# Altium project AMC_FMC_Carrier.PrjPcb (part 7 of 9)

## Sheet Clock_management.SchDoc
size 457 x 304 mm; DocumentNumber: 23; SheetNumber: 23; SheetTotal: 30
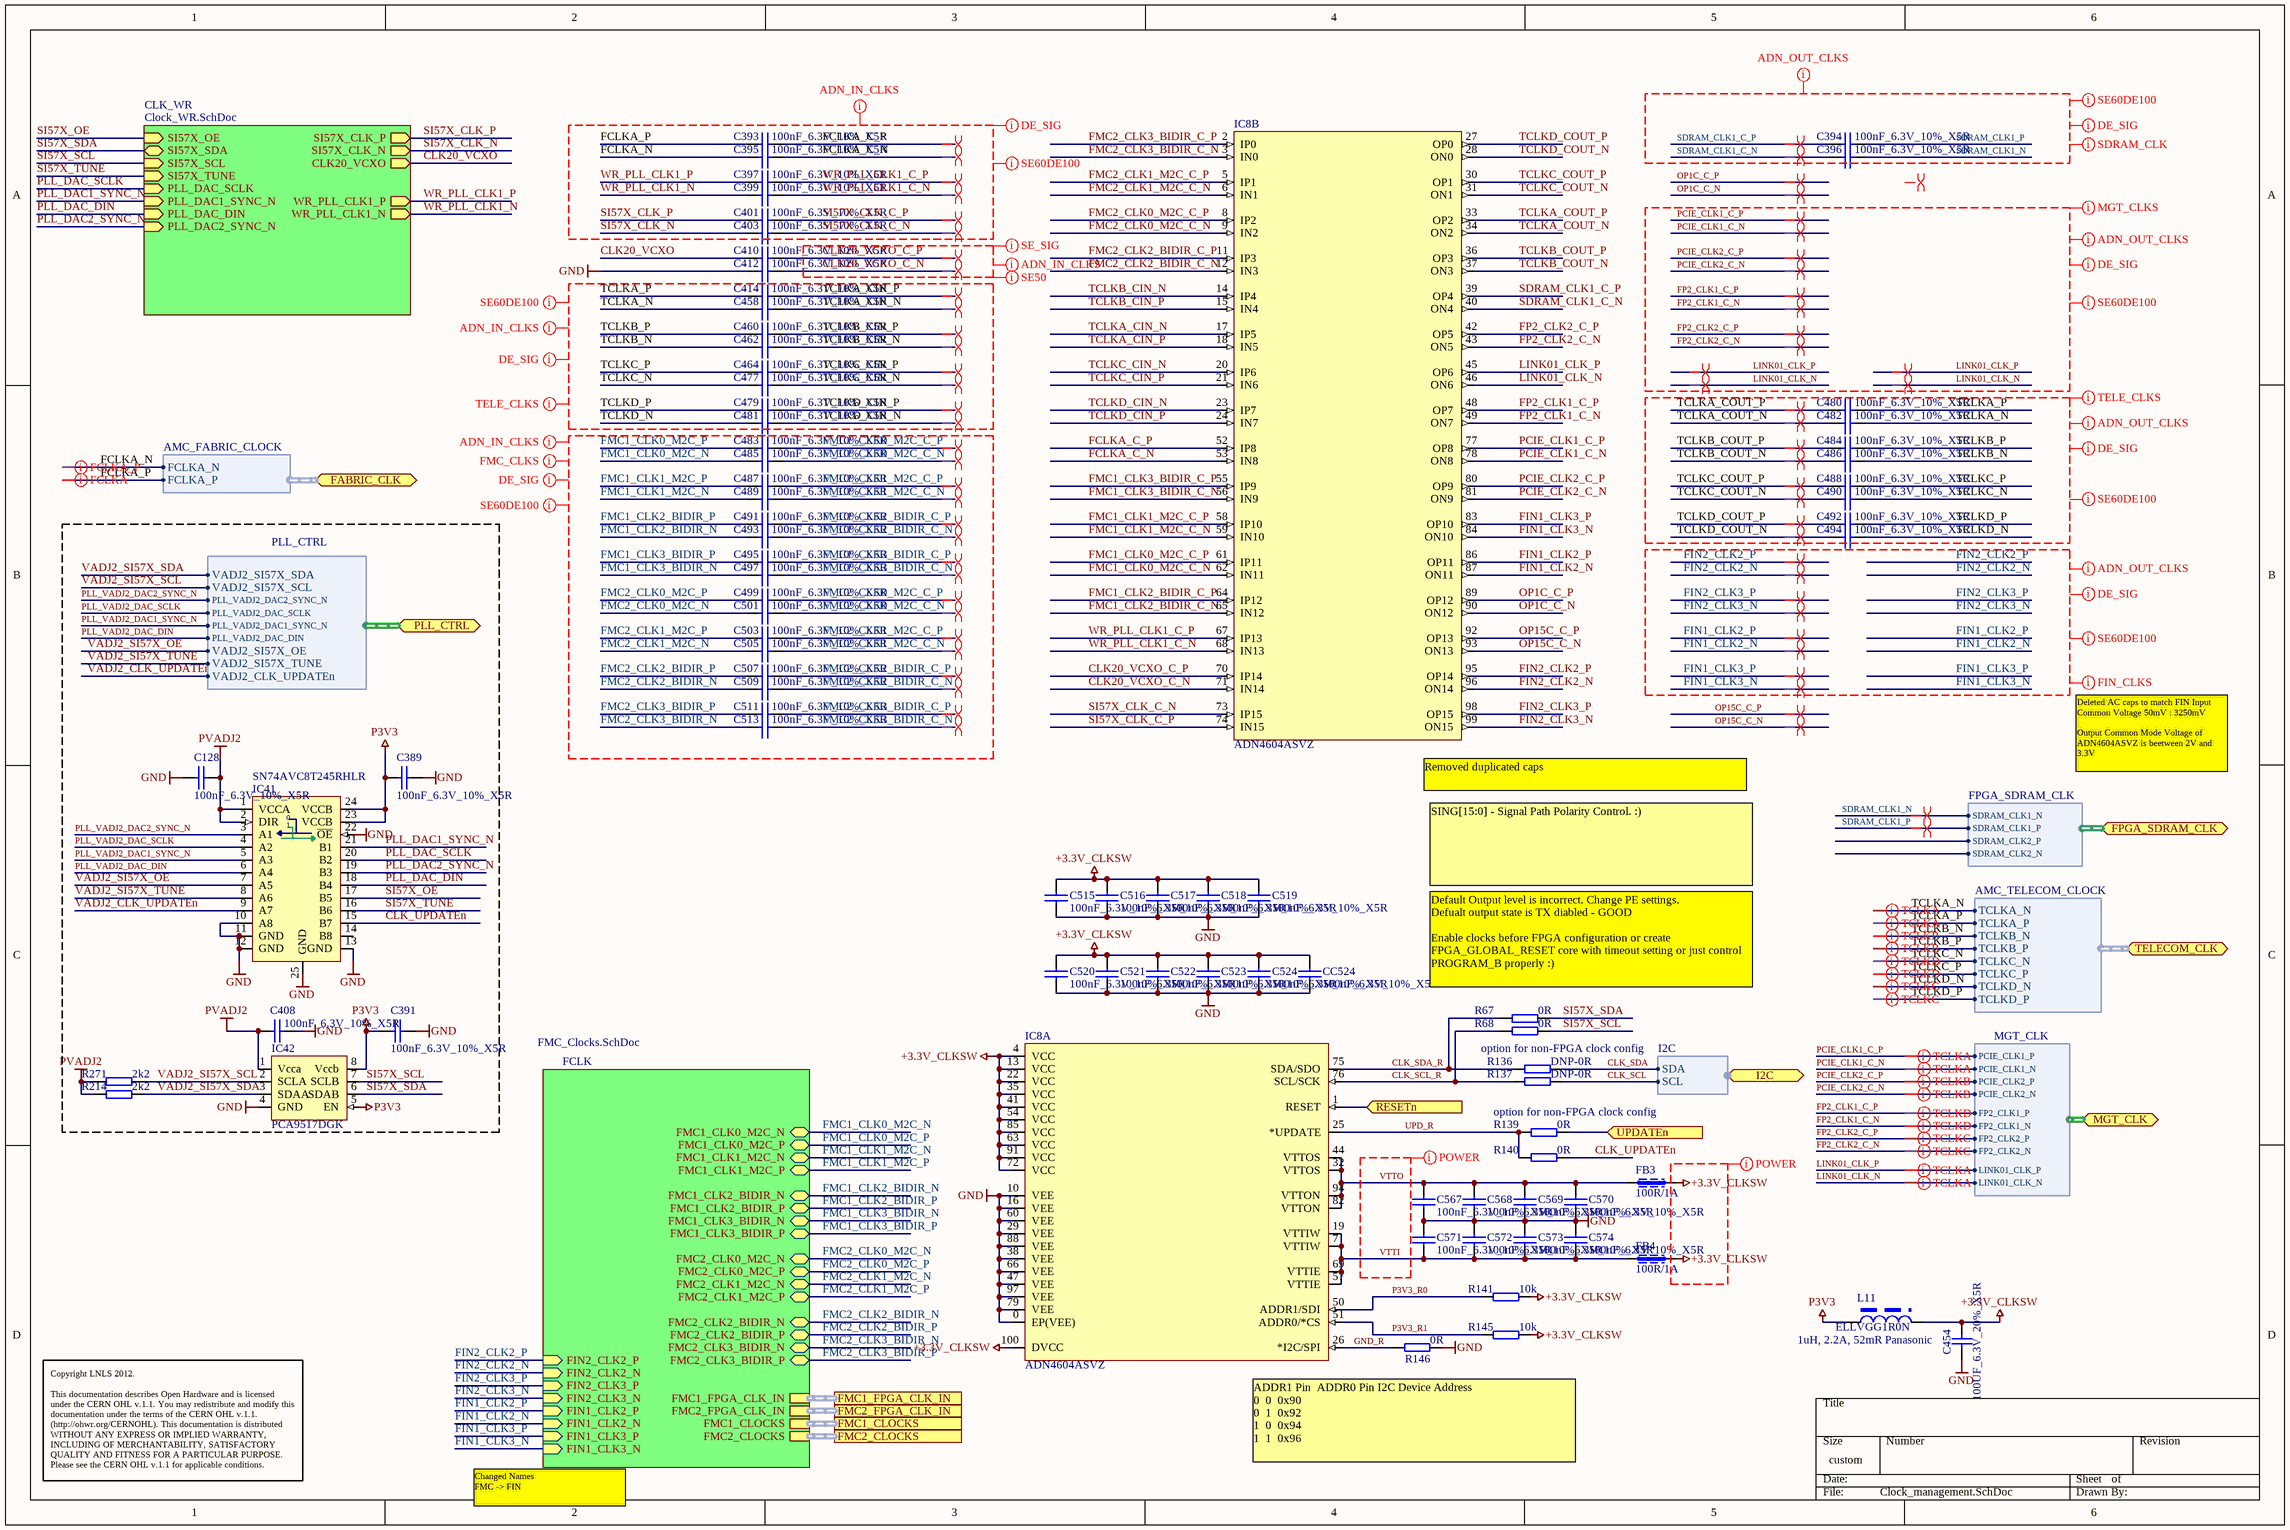
[diagram p17: Clock_management.SchDoc]

### Parts
C128  100nF_6.3V_10%_X5R  [0201C]
C389  100nF_6.3V_10%_X5R  [0201C]
C391  100nF_6.3V_10%_X5R  [0201C]
C393  100nF_6.3V_10%_X5R  [0201C]
C394  100nF_6.3V_10%_X5R  [0201C]
C395  100nF_6.3V_10%_X5R  [0201C]
C396  100nF_6.3V_10%_X5R  [0201C]
C397  100nF_6.3V_10%_X5R  [0201C]
C399  100nF_6.3V_10%_X5R  [0201C]
C401  100nF_6.3V_10%_X5R  [0201C]
C403  100nF_6.3V_10%_X5R  [0201C]
C408  100nF_6.3V_10%_X5R  [0201C]
C410  100nF_6.3V_10%_X5R  [0201C]
C412  100nF_6.3V_10%_X5R  [0201C]
C414  100nF_6.3V_10%_X5R  [0201C]
C454  100UF_6.3V_20%_X5R  [CAPC3225X270N]
C458  100nF_6.3V_10%_X5R  [0201C]
C460  100nF_6.3V_10%_X5R  [0201C]
C462  100nF_6.3V_10%_X5R  [0201C]
C464  100nF_6.3V_10%_X5R  [0201C]
C477  100nF_6.3V_10%_X5R  [0201C]
C479  100nF_6.3V_10%_X5R  [0201C]
C480  100nF_6.3V_10%_X5R  [0201C]
C481  100nF_6.3V_10%_X5R  [0201C]
C482  100nF_6.3V_10%_X5R  [0201C]
C483  100nF_6.3V_10%_X5R  [0201C]
C484  100nF_6.3V_10%_X5R  [0201C]
C485  100nF_6.3V_10%_X5R  [0201C]
C486  100nF_6.3V_10%_X5R  [0201C]
C487  100nF_6.3V_10%_X5R  [0201C]
C488  100nF_6.3V_10%_X5R  [0201C]
C489  100nF_6.3V_10%_X5R  [0201C]
C490  100nF_6.3V_10%_X5R  [0201C]
C491  100nF_6.3V_10%_X5R  [0201C]
C492  100nF_6.3V_10%_X5R  [0201C]
C493  100nF_6.3V_10%_X5R  [0201C]
C494  100nF_6.3V_10%_X5R  [0201C]
C495  100nF_6.3V_10%_X5R  [0201C]
C497  100nF_6.3V_10%_X5R  [0201C]
C499  100nF_6.3V_10%_X5R  [0201C]
C501  100nF_6.3V_10%_X5R  [0201C]
C503  100nF_6.3V_10%_X5R  [0201C]
C505  100nF_6.3V_10%_X5R  [0201C]
C507  100nF_6.3V_10%_X5R  [0201C]
C509  100nF_6.3V_10%_X5R  [0201C]
C511  100nF_6.3V_10%_X5R  [0201C]
C513  100nF_6.3V_10%_X5R  [0201C]
C515  100nF_6.3V_10%_X5R  [0201C]
C516  100nF_6.3V_10%_X5R  [0201C]
C517  100nF_6.3V_10%_X5R  [0201C]
C518  100nF_6.3V_10%_X5R  [0201C]
C519  100nF_6.3V_10%_X5R  [0201C]
C520  100nF_6.3V_10%_X5R  [0201C]
C521  100nF_6.3V_10%_X5R  [0201C]
C522  100nF_6.3V_10%_X5R  [0201C]
C523  100nF_6.3V_10%_X5R  [0201C]
C524  100nF_6.3V_10%_X5R  [0201C]
C567  100nF_6.3V_10%_X5R  [0201C]
C568  100nF_6.3V_10%_X5R  [0201C]
C569  100nF_6.3V_10%_X5R  [0201C]
C570  100nF_6.3V_10%_X5R  [0201C]
C571  100nF_6.3V_10%_X5R  [0201C]
C572  100nF_6.3V_10%_X5R  [0201C]
C573  100nF_6.3V_10%_X5R  [0201C]
C574  100nF_6.3V_10%_X5R  [0201C]
CC524  100nF_6.3V_10%_X5R  [0201C]
FB3  100R/1A  [0603L]
FB4  100R/1A  [0603L]
IC8  ADN4604ASVZ  [TQFP100_TP]  (parts A,B of 2)
IC41  SN74AVC8T245RHLR  [QFN50P350X550X100-24N]
IC42  PCA9517DGK  [msop-8]
L11  ELLVGG1R0N  [L_ELLVGG2R2N]
R67  0R  [0402R]
R68  0R  [0402R]
R136  DNP-0R  [0402R]
R137  DNP-0R  [0402R]
R139  0R  [0402R]
R140  0R  [0402R]
R141  10k  [0402R]
R145  10k  [0402R]
R146  0R  [0402R]
R214  2k2  [0402R]
R271  2k2  [0402R]

### Sub-sheets
CLK_WR = Clock_WR.SchDoc: SI57X_OE (in), SI57X_SDA (bidir), SI57X_SCL (in), SI57X_CLK_P (out), SI57X_CLK_N (out), CLK20_VCXO (out), SI57X_TUNE (in), PLL_DAC_SCLK (in), PLL_DAC1_SYNC_N (in), PLL_DAC_DIN (in), PLL_DAC2_SYNC_N (in), WR_PLL_CLK1_P (out), WR_PLL_CLK1_N (out)
FCLK = FMC_Clocks.SchDoc: FMC2_CLOCKS (harness FMC_CLOCKS), FMC1_FPGA_CLK_IN (harness FMC_FPGA_CLK_IN), FMC2_FPGA_CLK_IN (harness FMC_FPGA_CLK_IN), FMC1_CLOCKS (harness FMC_CLOCKS), FIN2_CLK2_P (in), FIN2_CLK2_N (in), FIN2_CLK3_P (in), FIN2_CLK3_N (in), FIN1_CLK2_P (in), FIN1_CLK2_N (in), FIN1_CLK3_P (in), FIN1_CLK3_N (in), FMC2_CLK0_M2C_N, FMC2_CLK0_M2C_P, FMC2_CLK1_M2C_N, FMC2_CLK1_M2C_P, FMC2_CLK2_BIDIR_N, FMC2_CLK2_BIDIR_P, FMC2_CLK3_BIDIR_N, FMC2_CLK3_BIDIR_P, FMC1_CLK0_M2C_N, FMC1_CLK0_M2C_P, FMC1_CLK1_M2C_N, FMC1_CLK1_M2C_P, FMC1_CLK2_BIDIR_N, FMC1_CLK2_BIDIR_P, FMC1_CLK3_BIDIR_N, FMC1_CLK3_BIDIR_P

### Ports
FABRIC_CLK (harness AMC_FABRIC_CLOCK), FMC1_CLOCKS (harness FMC_CLOCKS), FMC1_FPGA_CLK_IN (harness FMC_FPGA_CLK_IN), FMC2_CLOCKS (harness FMC_CLOCKS), FMC2_FPGA_CLK_IN (harness FMC_FPGA_CLK_IN), FPGA_SDRAM_CLK (harness FPGA_SDRAM_CLK), I2C (harness I2C), MGT_CLK (harness MGT_CLK), PLL_CTRL (harness PLL_CTRL), RESETn (in), TELECOM_CLK (harness AMC_TELECOM_CLOCK), UPDATEn (in)

### Harnesses
AMC_FABRIC_CLOCK: FCLKA_N, FCLKA_P
AMC_TELECOM_CLOCK: TCLKA_N, TCLKA_P, TCLKB_N, TCLKB_P, TCLKC_N, TCLKC_P, TCLKD_N, TCLKD_P
MGT_CLK: PCIE_CLK1_P, PCIE_CLK1_N, PCIE_CLK2_P, PCIE_CLK2_N, FP2_CLK1_P, FP2_CLK1_N, FP2_CLK2_P, FP2_CLK2_N, LINK01_CLK_P, LINK01_CLK_N
FPGA_SDRAM_CLK: SDRAM_CLK1_N, SDRAM_CLK1_P, SDRAM_CLK2_P, SDRAM_CLK2_N
PLL_CTRL: PLL_VADJ2_DAC2_SYNC_N, PLL_VADJ2_DAC_SCLK, PLL_VADJ2_DAC1_SYNC_N, PLL_VADJ2_DAC_DIN, VADJ2_SI57X_OE, VADJ2_SI57X_TUNE, VADJ2_SI57X_SDA, VADJ2_SI57X_SCL, VADJ2_CLK_UPDATEn
I2C: SCL, SDA

### Nets
+3.3V_CLKSW: C454.2 C515.2 C516.2 C517.2 C518.2 C519.2 C520.2 C521.2 C522.2 C523.2 C524.2 CC524.2 FB3.2 FB4.2 IC8.4(VCC) IC8.13(VCC) IC8.22(VCC) IC8.35(VCC) IC8.41(VCC) IC8.54(VCC) IC8.63(VCC) IC8.72(VCC) IC8.85(VCC) IC8.91(VCC) IC8.100(DVCC) L11.2 R141.2 R145.2
GND: C128.1 C389.1 C391.1 C408.1 C412.1 C454.1 C515.1 C516.1 C517.1 C518.1 C519.1 C520.1 C521.1 C522.1 C523.1 C524.1 C567.1 C568.1 C569.1 C570.1 C571.2 C572.2 C573.2 C574.2 CC524.1 IC8.0(EP(VEE)) IC8.10(VEE) IC8.16(VEE) IC8.29(VEE) IC8.38(VEE) IC8.47(VEE) IC8.60(VEE) IC8.66(VEE) IC8.79(VEE) IC8.88(VEE) IC8.97(VEE) IC41.10(A8) IC41.11(GND) IC41.12(GND) IC41.13(GND) IC41.22(~{OE}) IC41.25(GND) IC42.4(GND) R146.2
P3V3: C389.2 C391.2 IC41.23(VCCB) IC41.24(VCCB) IC42.5(EN) IC42.8(Vccb) L11.1
PVADJ2: C128.2 C408.2 IC41.1(VCCA) IC41.2(DIR) IC42.1(Vcca) R214.1 R271.1
CLK20_VCXO: C410.1 ; sheet CLK_WR/CLK20_VCXO
CLK20_VCXO_C_N: C412.2 IC8.71(IN14)
CLK20_VCXO_C_P: C410.2 IC8.70(IP14)
CLK_SCL: R137.2 ; port I2C.SCL  [project net CPU.SCL]
CLK_SCL_R: IC8.76(SCL/SCK) R68.1 R137.1
CLK_SDA: R136.2 ; port I2C.SDA  [project net CPU.SDA]
CLK_SDA_R: IC8.75(SDA/SDO) R67.1 R136.1
CLK_UPDATEn: IC41.15(B7) R140.2
FCLKA_C_N: C395.2 IC8.53(IN8)
FCLKA_C_P: C393.2 IC8.52(IP8)
FCLKA_N: C395.1 ; port FABRIC_CLK.FCLKA_N
FCLKA_P: C393.1 ; port FABRIC_CLK.FCLKA_P
FIN1_CLK2_N: IC8.87(ON11) ; sheet FCLK/FIN1_CLK2_N
FIN1_CLK2_P: IC8.86(OP11) ; sheet FCLK/FIN1_CLK2_P
FIN1_CLK3_N: IC8.84(ON10) ; sheet FCLK/FIN1_CLK3_N
FIN1_CLK3_P: IC8.83(OP10) ; sheet FCLK/FIN1_CLK3_P
FIN2_CLK2_N: IC8.96(ON14) ; sheet FCLK/FIN2_CLK2_N
FIN2_CLK2_P: IC8.95(OP14) ; sheet FCLK/FIN2_CLK2_P
FIN2_CLK3_N: IC8.99(ON15) ; sheet FCLK/FIN2_CLK3_N
FIN2_CLK3_P: IC8.98(OP15) ; sheet FCLK/FIN2_CLK3_P
FMC1_CLK0_M2C_C_N: C485.2 IC8.62(IN11)
FMC1_CLK0_M2C_C_P: C483.2 IC8.61(IP11)
FMC1_CLK0_M2C_N: C485.1 ; sheet FCLK/FMC1_CLK0_M2C_N  [project net CLKS1.CLK0_M2C_N]
FMC1_CLK0_M2C_P: C483.1 ; sheet FCLK/FMC1_CLK0_M2C_P  [project net CLKS1.CLK0_M2C_P]
FMC1_CLK1_M2C_C_N: C489.2 IC8.59(IN10)
FMC1_CLK1_M2C_C_P: C487.2 IC8.58(IP10)
FMC1_CLK1_M2C_N: C489.1 ; sheet FCLK/FMC1_CLK1_M2C_N  [project net CLKS1.CLK1_M2C_N]
FMC1_CLK1_M2C_P: C487.1 ; sheet FCLK/FMC1_CLK1_M2C_P  [project net CLKS1.CLK1_M2C_P]
FMC1_CLK2_BIDIR_C_N: C493.2 IC8.65(IN12)
FMC1_CLK2_BIDIR_C_P: C491.2 IC8.64(IP12)
FMC1_CLK2_BIDIR_N: C493.1 ; sheet FCLK/FMC1_CLK2_BIDIR_N  [project net CLKS1.CLK2_BIDIR_N]
FMC1_CLK2_BIDIR_P: C491.1 ; sheet FCLK/FMC1_CLK2_BIDIR_P  [project net CLKS1.CLK2_BIDIR_P]
FMC1_CLK3_BIDIR_C_N: C497.2 IC8.56(IN9)
FMC1_CLK3_BIDIR_C_P: C495.2 IC8.55(IP9)
FMC1_CLK3_BIDIR_N: C497.1 ; sheet FCLK/FMC1_CLK3_BIDIR_N  [project net CLKS1.CLK3_BIDIR_N]
FMC1_CLK3_BIDIR_P: C495.1 ; sheet FCLK/FMC1_CLK3_BIDIR_P  [project net CLKS1.CLK3_BIDIR_P]
FMC2_CLK0_M2C_C_N: C501.2 IC8.9(IN2)
FMC2_CLK0_M2C_C_P: C499.2 IC8.8(IP2)
FMC2_CLK0_M2C_N: C501.1 ; sheet FCLK/FMC2_CLK0_M2C_N  [project net CLKS2.CLK0_M2C_N]
FMC2_CLK0_M2C_P: C499.1 ; sheet FCLK/FMC2_CLK0_M2C_P  [project net CLKS2.CLK0_M2C_P]
FMC2_CLK1_M2C_C_N: C505.2 IC8.6(IN1)
FMC2_CLK1_M2C_C_P: C503.2 IC8.5(IP1)
FMC2_CLK1_M2C_N: C505.1 ; sheet FCLK/FMC2_CLK1_M2C_N  [project net CLKS2.CLK1_M2C_N]
FMC2_CLK1_M2C_P: C503.1 ; sheet FCLK/FMC2_CLK1_M2C_P  [project net CLKS2.CLK1_M2C_P]
FMC2_CLK2_BIDIR_C_N: C509.2 IC8.12(IN3)
FMC2_CLK2_BIDIR_C_P: C507.2 IC8.11(IP3)
FMC2_CLK2_BIDIR_N: C509.1 ; sheet FCLK/FMC2_CLK2_BIDIR_N  [project net CLKS2.CLK2_BIDIR_N]
FMC2_CLK2_BIDIR_P: C507.1 ; sheet FCLK/FMC2_CLK2_BIDIR_P  [project net CLKS2.CLK2_BIDIR_P]
FMC2_CLK3_BIDIR_C_N: C513.2 IC8.3(IN0)
FMC2_CLK3_BIDIR_C_P: C511.2 IC8.2(IP0)
FMC2_CLK3_BIDIR_N: C513.1 ; sheet FCLK/FMC2_CLK3_BIDIR_N  [project net CLKS2.CLK3_BIDIR_N]
FMC2_CLK3_BIDIR_P: C511.1 ; sheet FCLK/FMC2_CLK3_BIDIR_P  [project net CLKS2.CLK3_BIDIR_P]
FP2_CLK1_C_N: IC8.49(ON7) ; port MGT_CLK.FP2_CLK1_N  [project net MGT.FP2_CLK1_N]
FP2_CLK1_C_P: IC8.48(OP7) ; port MGT_CLK.FP2_CLK1_P  [project net MGT.FP2_CLK1_P]
FP2_CLK2_C_N: IC8.43(ON5) ; port MGT_CLK.FP2_CLK2_N  [project net MGT.FP2_CLK2_N]
FP2_CLK2_C_P: IC8.42(OP5) ; port MGT_CLK.FP2_CLK2_P  [project net MGT.FP2_CLK2_P]
GND_R: IC8.26(*I2C/SPI) R146.1
LINK01_CLK_N: IC8.46(ON6) ; port MGT_CLK.LINK01_CLK_N  [project net MGT.LINK01_CLK_N]
LINK01_CLK_P: IC8.45(OP6) ; port MGT_CLK.LINK01_CLK_P  [project net MGT.LINK01_CLK_P]
OP1C_C_N: IC8.90(ON12)
OP1C_C_P: IC8.89(OP12)
OP15C_C_N: IC8.93(ON13)
OP15C_C_P: IC8.92(OP13)
P3V3_R0: IC8.50(ADDR1/SDI) R141.1
P3V3_R1: IC8.51(ADDR0/*CS) R145.1
PCIE_CLK1_C_N: IC8.78(ON8) ; port MGT_CLK.PCIE_CLK1_N  [project net MGT.PCIE_CLK1_N]
PCIE_CLK1_C_P: IC8.77(OP8) ; port MGT_CLK.PCIE_CLK1_P  [project net MGT.PCIE_CLK1_P]
PCIE_CLK2_C_N: IC8.81(ON9) ; port MGT_CLK.PCIE_CLK2_N  [project net MGT.PCIE_CLK2_N]
PCIE_CLK2_C_P: IC8.80(OP9) ; port MGT_CLK.PCIE_CLK2_P  [project net MGT.PCIE_CLK2_P]
PLL_DAC1_SYNC_N: IC41.21(B1) ; sheet CLK_WR/PLL_DAC1_SYNC_N
PLL_DAC2_SYNC_N: IC41.19(B3) ; sheet CLK_WR/PLL_DAC2_SYNC_N
PLL_DAC_DIN: IC41.18(B4) ; sheet CLK_WR/PLL_DAC_DIN
PLL_DAC_SCLK: IC41.20(B2) ; sheet CLK_WR/PLL_DAC_SCLK
PLL_VADJ2_DAC1_SYNC_N: IC41.5(A3) ; port PLL_CTRL.PLL_VADJ2_DAC1_SYNC_N  [project net PLL_CTRL.PLL_VADJ2_DAC1_SYNC_N]
PLL_VADJ2_DAC2_SYNC_N: IC41.3(A1) ; port PLL_CTRL.PLL_VADJ2_DAC2_SYNC_N  [project net PLL_CTRL.PLL_VADJ2_DAC2_SYNC_N]
PLL_VADJ2_DAC_DIN: IC41.6(A4) ; port PLL_CTRL.PLL_VADJ2_DAC_DIN  [project net PLL_CTRL.PLL_VADJ2_DAC_DIN]
PLL_VADJ2_DAC_SCLK: IC41.4(A2) ; port PLL_CTRL.PLL_VADJ2_DAC_SCLK  [project net PLL_CTRL.PLL_VADJ2_DAC_SCLK]
RESETn: IC8.1(RESET) ; port RESETn
SDRAM_CLK1_C_N: C396.1 IC8.40(ON4)
SDRAM_CLK1_C_P: C394.1 IC8.39(OP4)
SDRAM_CLK1_N: C396.2 ; port FPGA_SDRAM_CLK.SDRAM_CLK1_N  [project net FSDC.SDRAM_CLK1_N]
SDRAM_CLK1_P: C394.2 ; port FPGA_SDRAM_CLK.SDRAM_CLK1_P  [project net FSDC.SDRAM_CLK1_P]
SI57X_CLK_C_N: C403.2 IC8.73(IP15)
SI57X_CLK_C_P: C401.2 IC8.74(IN15)
SI57X_CLK_N: C403.1 ; sheet CLK_WR/SI57X_CLK_N
SI57X_CLK_P: C401.1 ; sheet CLK_WR/SI57X_CLK_P
SI57X_OE: IC41.17(B5) ; sheet CLK_WR/SI57X_OE
SI57X_SCL: IC42.7(SCLB) R68.2 ; sheet CLK_WR/SI57X_SCL
SI57X_SDA: IC42.6(SDAB) R67.2 ; sheet CLK_WR/SI57X_SDA
SI57X_TUNE: IC41.16(B6) ; sheet CLK_WR/SI57X_TUNE
TCLKA_CIN_N: C458.2 IC8.17(IP5)
TCLKA_CIN_P: C414.2 IC8.18(IN5)
TCLKA_COUT_N: C482.1 IC8.34(ON2)
TCLKA_COUT_P: C480.1 IC8.33(OP2)
TCLKA_N: C458.1 C482.2 ; port TELECOM_CLK.TCLKA_N
TCLKA_P: C414.1 C480.2 ; port TELECOM_CLK.TCLKA_P
TCLKB_CIN_N: C462.2 IC8.14(IP4)
TCLKB_CIN_P: C460.2 IC8.15(IN4)
TCLKB_COUT_N: C486.1 IC8.37(ON3)
TCLKB_COUT_P: C484.1 IC8.36(OP3)
TCLKB_N: C462.1 C486.2 ; port TELECOM_CLK.TCLKB_N
TCLKB_P: C460.1 C484.2 ; port TELECOM_CLK.TCLKB_P
TCLKC_CIN_N: C477.2 IC8.20(IP6)
TCLKC_CIN_P: C464.2 IC8.21(IN6)
TCLKC_COUT_N: C490.1 IC8.31(ON1)
TCLKC_COUT_P: C488.1 IC8.30(OP1)
TCLKC_N: C477.1 C490.2 ; port TELECOM_CLK.TCLKC_N
TCLKC_P: C464.1 C488.2 ; port TELECOM_CLK.TCLKC_P
TCLKD_CIN_N: C481.2 IC8.23(IP7)
TCLKD_CIN_P: C479.2 IC8.24(IN7)
TCLKD_COUT_N: C494.1 IC8.28(ON0)
TCLKD_COUT_P: C492.1 IC8.27(OP0)
TCLKD_N: C481.1 C494.2 ; port TELECOM_CLK.TCLKD_N
TCLKD_P: C479.1 C492.2 ; port TELECOM_CLK.TCLKD_P
UPD_R: IC8.25(*UPDATE) R139.1 R140.1
UPDATEn: R139.2 ; port UPDATEn
VADJ2_CLK_UPDATEn: IC41.9(A7) ; port PLL_CTRL.VADJ2_CLK_UPDATEn  [project net PLL_CTRL.VADJ2_CLK_UPDATEn]
VADJ2_SI57X_OE: IC41.7(A5) ; port PLL_CTRL.VADJ2_SI57X_OE  [project net PLL_CTRL.VADJ2_SI57X_OE]
VADJ2_SI57X_SCL: IC42.2(SCLA) R271.2 ; port PLL_CTRL.VADJ2_SI57X_SCL  [project net PLL_CTRL.VADJ2_SI57X_SCL]
VADJ2_SI57X_SDA: IC42.3(SDAA) R214.2 ; port PLL_CTRL.VADJ2_SI57X_SDA  [project net PLL_CTRL.VADJ2_SI57X_SDA]
VADJ2_SI57X_TUNE: IC41.8(A6) ; port PLL_CTRL.VADJ2_SI57X_TUNE  [project net PLL_CTRL.VADJ2_SI57X_TUNE]
VTTI: C571.1 C572.1 C573.1 C574.1 FB4.1 IC8.7(VTTIW) IC8.19(VTTIW) IC8.57(VTTIE) IC8.69(VTTIE)
VTTO: C567.2 C568.2 C569.2 C570.2 FB3.1 IC8.32(VTTOS) IC8.44(VTTOS) IC8.82(VTTON) IC8.94(VTTON)
WR_PLL_CLK1_C_N: C399.2 IC8.68(IN13)
WR_PLL_CLK1_C_P: C397.2 IC8.67(IP13)
WR_PLL_CLK1_N: C399.1 ; sheet CLK_WR/WR_PLL_CLK1_N
WR_PLL_CLK1_P: C397.1 ; sheet CLK_WR/WR_PLL_CLK1_P

Not connected (* = marked no-connect by the designer): IC41 14(B8)

### Buses and harness runs
harness port FMC1_CLOCKS = sheet FCLK/FMC1_CLOCKS
harness port FMC1_FPGA_CLK_IN = sheet FCLK/FMC1_FPGA_CLK_IN
harness port FMC2_CLOCKS = sheet FCLK/FMC2_CLOCKS
harness port FMC2_FPGA_CLK_IN = sheet FCLK/FMC2_FPGA_CLK_IN

### Layout directives
differential pair: (no net found under the mark), CLK20_VCXO_C_N, CLK20_VCXO_C_P, FCLKA_C_N, FCLKA_C_P, FCLKA_N, FCLKA_P, FIN1_CLK2_N, FIN1_CLK2_P, FIN1_CLK3_N, FIN1_CLK3_P, FIN2_CLK2_N, FIN2_CLK2_P, FIN2_CLK3_N, FIN2_CLK3_P, FMC1_CLK0_M2C_C_N, FMC1_CLK0_M2C_C_P, FMC1_CLK1_M2C_C_N, FMC1_CLK1_M2C_C_P, FMC1_CLK2_BIDIR_C_N, FMC1_CLK2_BIDIR_C_P, FMC1_CLK3_BIDIR_C_N, FMC1_CLK3_BIDIR_C_P, FMC2_CLK0_M2C_C_N, FMC2_CLK0_M2C_C_P, FMC2_CLK1_M2C_C_N, FMC2_CLK1_M2C_C_P, FMC2_CLK2_BIDIR_C_N, FMC2_CLK2_BIDIR_C_P, FMC2_CLK3_BIDIR_C_N, FMC2_CLK3_BIDIR_C_P, FSDC.SDRAM_CLK1_N, FSDC.SDRAM_CLK1_P, MGT.FP2_CLK1_N, MGT.FP2_CLK1_P, MGT.FP2_CLK2_N, MGT.FP2_CLK2_P, MGT.LINK01_CLK_N, MGT.LINK01_CLK_P, MGT.PCIE_CLK1_N, MGT.PCIE_CLK1_P, MGT.PCIE_CLK2_N, MGT.PCIE_CLK2_P, OP1C_C_N, OP1C_C_P, OP15C_C_N, OP15C_C_P, SDRAM_CLK1_C_N, SDRAM_CLK1_C_P, SI57X_CLK_C_N, SI57X_CLK_C_P, TCLKA_CIN_N, TCLKA_CIN_P, TCLKA_COUT_N, TCLKA_COUT_P, TCLKA_N, TCLKA_P, TCLKB_CIN_N, TCLKB_CIN_P, TCLKB_COUT_N, TCLKB_COUT_P, TCLKB_N, TCLKB_P, TCLKC_CIN_N, TCLKC_CIN_P, TCLKC_COUT_N, TCLKC_COUT_P, TCLKC_N, TCLKC_P, TCLKD_CIN_N, TCLKD_CIN_P, TCLKD_COUT_N, TCLKD_COUT_P, TCLKD_N, TCLKD_P, WR_PLL_CLK1_C_N, WR_PLL_CLK1_C_P
net class MGT_CLKS: FP2_CLK1_C_N, FP2_CLK1_C_P, FP2_CLK2_C_N, FP2_CLK2_C_P, LINK01_CLK_N, LINK01_CLK_P, PCIE_CLK1_C_N, PCIE_CLK1_C_P, PCIE_CLK2_C_N, PCIE_CLK2_C_P
net class TELE_CLKS: TCLKA_CIN_N, TCLKA_CIN_P, TCLKA_COUT_N, TCLKA_COUT_P, TCLKA_N, TCLKA_P, TCLKB_CIN_N, TCLKB_CIN_P, TCLKB_COUT_N, TCLKB_COUT_P, TCLKB_N, TCLKB_P, TCLKC_CIN_N, TCLKC_CIN_P, TCLKC_COUT_N, TCLKC_COUT_P, TCLKC_N, TCLKC_P, TCLKD_CIN_N, TCLKD_CIN_P, TCLKD_COUT_N, TCLKD_COUT_P, TCLKD_N, TCLKD_P
net class SE60DE100: FCLKA_C_N, FCLKA_C_P, FCLKA_N, FCLKA_P, FIN1_CLK2_N, FIN1_CLK2_P, FIN1_CLK3_N, FIN1_CLK3_P, FIN2_CLK2_N, FIN2_CLK2_P, FIN2_CLK3_N, FIN2_CLK3_P, FMC1_CLK0_M2C_C_N, FMC1_CLK0_M2C_C_P, FMC1_CLK0_M2C_N, FMC1_CLK0_M2C_P, FMC1_CLK1_M2C_C_N, FMC1_CLK1_M2C_C_P, FMC1_CLK1_M2C_N, FMC1_CLK1_M2C_P, FMC1_CLK2_BIDIR_C_N, FMC1_CLK2_BIDIR_C_P, FMC1_CLK2_BIDIR_N, FMC1_CLK2_BIDIR_P, FMC1_CLK3_BIDIR_C_N, FMC1_CLK3_BIDIR_C_P, FMC1_CLK3_BIDIR_N, FMC1_CLK3_BIDIR_P, FMC2_CLK0_M2C_C_N, FMC2_CLK0_M2C_C_P, FMC2_CLK0_M2C_N, FMC2_CLK0_M2C_P, FMC2_CLK1_M2C_C_N, FMC2_CLK1_M2C_C_P, FMC2_CLK1_M2C_N, FMC2_CLK1_M2C_P, FMC2_CLK2_BIDIR_C_N, FMC2_CLK2_BIDIR_C_P, FMC2_CLK2_BIDIR_N, FMC2_CLK2_BIDIR_P, FMC2_CLK3_BIDIR_C_N, FMC2_CLK3_BIDIR_C_P, FMC2_CLK3_BIDIR_N, FMC2_CLK3_BIDIR_P, FP2_CLK1_C_N, FP2_CLK1_C_P, FP2_CLK2_C_N, FP2_CLK2_C_P, LINK01_CLK_N, LINK01_CLK_P, PCIE_CLK1_C_N, PCIE_CLK1_C_P, PCIE_CLK2_C_N, PCIE_CLK2_C_P, SDRAM_CLK1_C_N, SDRAM_CLK1_C_P, SDRAM_CLK1_N, SDRAM_CLK1_P, SI57X_CLK_C_N, SI57X_CLK_C_P, SI57X_CLK_N, SI57X_CLK_P, TCLKA_CIN_N, TCLKA_CIN_P, TCLKA_COUT_N, TCLKA_COUT_P, TCLKA_N, TCLKA_P, TCLKB_CIN_N, TCLKB_CIN_P, TCLKB_COUT_N, TCLKB_COUT_P, TCLKB_N, TCLKB_P, TCLKC_CIN_N, TCLKC_CIN_P, TCLKC_COUT_N, TCLKC_COUT_P, TCLKC_N, TCLKC_P, TCLKD_CIN_N, TCLKD_CIN_P, TCLKD_COUT_N, TCLKD_COUT_P, TCLKD_N, TCLKD_P, WR_PLL_CLK1_C_N, WR_PLL_CLK1_C_P, WR_PLL_CLK1_N, WR_PLL_CLK1_P
net class SDRAM_CLK: SDRAM_CLK1_C_N, SDRAM_CLK1_C_P, SDRAM_CLK1_N, SDRAM_CLK1_P
net class FMC_CLKS: FIN1_CLK2_N, FIN1_CLK2_P, FIN1_CLK3_N, FIN1_CLK3_P, FIN2_CLK2_N, FIN2_CLK2_P, FIN2_CLK3_N, FIN2_CLK3_P, FMC1_CLK0_M2C_C_N, FMC1_CLK0_M2C_C_P, FMC1_CLK0_M2C_N, FMC1_CLK0_M2C_P, FMC1_CLK1_M2C_C_N, FMC1_CLK1_M2C_C_P, FMC1_CLK1_M2C_N, FMC1_CLK1_M2C_P, FMC1_CLK2_BIDIR_C_N, FMC1_CLK2_BIDIR_C_P, FMC1_CLK2_BIDIR_N, FMC1_CLK2_BIDIR_P, FMC1_CLK3_BIDIR_C_N, FMC1_CLK3_BIDIR_C_P, FMC1_CLK3_BIDIR_N, FMC1_CLK3_BIDIR_P, FMC2_CLK0_M2C_C_N, FMC2_CLK0_M2C_C_P, FMC2_CLK0_M2C_N, FMC2_CLK0_M2C_P, FMC2_CLK1_M2C_C_N, FMC2_CLK1_M2C_C_P, FMC2_CLK1_M2C_N, FMC2_CLK1_M2C_P, FMC2_CLK2_BIDIR_C_N, FMC2_CLK2_BIDIR_C_P, FMC2_CLK2_BIDIR_N, FMC2_CLK2_BIDIR_P, FMC2_CLK3_BIDIR_C_N, FMC2_CLK3_BIDIR_C_P, FMC2_CLK3_BIDIR_N, FMC2_CLK3_BIDIR_P
net class DE_SIG: CLK20_VCXO_C_N, CLK20_VCXO_C_P, FCLKA_C_N, FCLKA_C_P, FCLKA_N, FCLKA_P, FIN1_CLK2_N, FIN1_CLK2_P, FIN1_CLK3_N, FIN1_CLK3_P, FIN2_CLK2_N, FIN2_CLK2_P, FIN2_CLK3_N, FIN2_CLK3_P, FMC1_CLK0_M2C_C_N, FMC1_CLK0_M2C_C_P, FMC1_CLK0_M2C_N, FMC1_CLK0_M2C_P, FMC1_CLK1_M2C_C_N, FMC1_CLK1_M2C_C_P, FMC1_CLK1_M2C_N, FMC1_CLK1_M2C_P, FMC1_CLK2_BIDIR_C_N, FMC1_CLK2_BIDIR_C_P, FMC1_CLK2_BIDIR_N, FMC1_CLK2_BIDIR_P, FMC1_CLK3_BIDIR_C_N, FMC1_CLK3_BIDIR_C_P, FMC1_CLK3_BIDIR_N, FMC1_CLK3_BIDIR_P, FMC2_CLK0_M2C_C_N, FMC2_CLK0_M2C_C_P, FMC2_CLK0_M2C_N, FMC2_CLK0_M2C_P, FMC2_CLK1_M2C_C_N, FMC2_CLK1_M2C_C_P, FMC2_CLK1_M2C_N, FMC2_CLK1_M2C_P, FMC2_CLK2_BIDIR_C_N, FMC2_CLK2_BIDIR_C_P, FMC2_CLK2_BIDIR_N, FMC2_CLK2_BIDIR_P, FMC2_CLK3_BIDIR_C_N, FMC2_CLK3_BIDIR_C_P, FMC2_CLK3_BIDIR_N, FMC2_CLK3_BIDIR_P, FP2_CLK1_C_N, FP2_CLK1_C_P, FP2_CLK2_C_N, FP2_CLK2_C_P, LINK01_CLK_N, LINK01_CLK_P, PCIE_CLK1_C_N, PCIE_CLK1_C_P, PCIE_CLK2_C_N, PCIE_CLK2_C_P, SDRAM_CLK1_C_N, SDRAM_CLK1_C_P, SDRAM_CLK1_N, SDRAM_CLK1_P, SI57X_CLK_C_N, SI57X_CLK_C_P, SI57X_CLK_N, SI57X_CLK_P, TCLKA_CIN_N, TCLKA_CIN_P, TCLKA_COUT_N, TCLKA_COUT_P, TCLKA_N, TCLKA_P, TCLKB_CIN_N, TCLKB_CIN_P, TCLKB_COUT_N, TCLKB_COUT_P, TCLKB_N, TCLKB_P, TCLKC_CIN_N, TCLKC_CIN_P, TCLKC_COUT_N, TCLKC_COUT_P, TCLKC_N, TCLKC_P, TCLKD_CIN_N, TCLKD_CIN_P, TCLKD_COUT_N, TCLKD_COUT_P, TCLKD_N, TCLKD_P, WR_PLL_CLK1_C_N, WR_PLL_CLK1_C_P, WR_PLL_CLK1_N, WR_PLL_CLK1_P
net class SE50: CLK20_VCXO_C_N, CLK20_VCXO_C_P
net class POWER: +3.3V_CLKSW, VTTI, VTTO
net class ADN_IN_CLKS: CLK20_VCXO_C_N, CLK20_VCXO_C_P, FCLKA_C_N, FCLKA_C_P, FCLKA_N, FCLKA_P, FMC1_CLK0_M2C_C_N, FMC1_CLK0_M2C_C_P, FMC1_CLK0_M2C_N, FMC1_CLK0_M2C_P, FMC1_CLK1_M2C_C_N, FMC1_CLK1_M2C_C_P, FMC1_CLK1_M2C_N, FMC1_CLK1_M2C_P, FMC1_CLK2_BIDIR_C_N, FMC1_CLK2_BIDIR_C_P, FMC1_CLK2_BIDIR_N, FMC1_CLK2_BIDIR_P, FMC1_CLK3_BIDIR_C_N, FMC1_CLK3_BIDIR_C_P, FMC1_CLK3_BIDIR_N, FMC1_CLK3_BIDIR_P, FMC2_CLK0_M2C_C_N, FMC2_CLK0_M2C_C_P, FMC2_CLK0_M2C_N, FMC2_CLK0_M2C_P, FMC2_CLK1_M2C_C_N, FMC2_CLK1_M2C_C_P, FMC2_CLK1_M2C_N, FMC2_CLK1_M2C_P, FMC2_CLK2_BIDIR_C_N, FMC2_CLK2_BIDIR_C_P, FMC2_CLK2_BIDIR_N, FMC2_CLK2_BIDIR_P, FMC2_CLK3_BIDIR_C_N, FMC2_CLK3_BIDIR_C_P, FMC2_CLK3_BIDIR_N, FMC2_CLK3_BIDIR_P, SI57X_CLK_C_N, SI57X_CLK_C_P, SI57X_CLK_N, SI57X_CLK_P, TCLKA_CIN_N, TCLKA_CIN_P, TCLKA_N, TCLKA_P, TCLKB_CIN_N, TCLKB_CIN_P, TCLKB_N, TCLKB_P, TCLKC_CIN_N, TCLKC_CIN_P, TCLKC_N, TCLKC_P, TCLKD_CIN_N, TCLKD_CIN_P, TCLKD_N, TCLKD_P, WR_PLL_CLK1_C_N, WR_PLL_CLK1_C_P, WR_PLL_CLK1_N, WR_PLL_CLK1_P
net class ADN_OUT_CLKS: FIN1_CLK2_N, FIN1_CLK2_P, FIN1_CLK3_N, FIN1_CLK3_P, FIN2_CLK2_N, FIN2_CLK2_P, FIN2_CLK3_N, FIN2_CLK3_P, FP2_CLK1_C_N, FP2_CLK1_C_P, FP2_CLK2_C_N, FP2_CLK2_C_P, LINK01_CLK_N, LINK01_CLK_P, PCIE_CLK1_C_N, PCIE_CLK1_C_P, PCIE_CLK2_C_N, PCIE_CLK2_C_P, SDRAM_CLK1_C_N, SDRAM_CLK1_C_P, SDRAM_CLK1_N, SDRAM_CLK1_P, TCLKA_COUT_N, TCLKA_COUT_P, TCLKA_N, TCLKA_P, TCLKB_COUT_N, TCLKB_COUT_P, TCLKB_N, TCLKB_P, TCLKC_COUT_N, TCLKC_COUT_P, TCLKC_N, TCLKC_P, TCLKD_COUT_N, TCLKD_COUT_P, TCLKD_N, TCLKD_P

### Notes on the sheet
- (near IC8) Removed duplicated caps
- Deleted AC caps to match FIN Input Common Voltage 50mV : 3250mV
  Output Common Mode Voltage of ADN4604ASVZ is beetween 2V and 3.3V
- SING[15:0] - Signal Path Polarity Control. :)
- Default Output level is incorrect. Change PE settings.
  Defualt output state is TX diabled - GOOD
  Enable clocks before FPGA configuration or create FPGA_GLOBAL_RESET core with timeout setting or just control PROGRAM_B properly :)
- option for non-FPGA clock config
- (near R139) option for non-FPGA clock config
- Copyright LNLS 2012.
  This documentation describes Open Hardware and is licensed under the CERN OHL v.1.1. You may redistribute and modify this documentation under the terms of the CERN OHL v.1.1. (http://ohwr.org/CERNOHL). This documentation is distributed WITHOUT ANY EXPRESS OR IMPLIED WARRANTY, INCLUDING OF MERCHANTABILITY, SATISFACTORY QUALITY AND FITNESS FOR A PARTICULAR PURPOSE. Please see the CERN OHL v.1.1 for applicable conditions.
- ADDR1 Pin 	ADDR0 Pin	I2C Device Address
  0		0		0x90
  0		1		0x92
  1		0		0x94
  1		1		0x96
- Changed Names
  FMC -> FIN
- (in symbol 74AVC8T245_QFN) 0
- (in symbol L_CHOKE_ELLVGG) 1uH, 2.2A, 52mR Panasonic

### Library data of the parts
C128 C389 C391 C393-C397 C399 C401 C403 C408 C410 C412 C414 C458 C460 C462 C464 C477 C479-C495 C497 C499 C501 C503 C505 C507 C509 C511 C513 C515-C524 C567-C574 CC524 = CAP_SMD_0201: Capacitor SMD
C454 = CC1210_100UF_6.3V_20%_X5R: Non-polarised capacitor; Part Description: SMD Multilayer Chip Ceramic Capacitor; Manufacturer: GENERIC; Manufacturer1 Part Number: GRM32ER60J107ME20L; Value: 100uF; Voltage: 6.3V; TC: X5R; Tolerance: ±20%; Table: Capacitors SMD; Part Number: CC1210_100UF_6.3V_20%_X5R; Component Kind: Standard; Component Type: Standard; Pin Count: 2; Status: Preferred; Manufacturer Part Number: CC1210_100UF_6.3V_20%_X5R; Case: 1210; Mounted: Yes; Socket: No; SMD: Yes; Manufacturer1 Example: MURATA; Manufacturer1 ComponentHeight: 2.70mm; HelpURL: \\cern.ch\dfs\Applications\Altium\Datasheets\CC1210_X5R_MURATA.pdf; Author: CERN DEM JLC; CreateDate: 2010-04-19; LatestRevisionDate: 2010-04-19
FB3 FB4 = L_FERRITE_BEAD_0603: ferrite bead 100R@100MHz 1A; Supplier 1: Newark; Supplier Part Number 1: 89R3144
IC8 = IFC_ADN4604ASVZ: 16x16 CML crosspoint switch; RefDes: RefDes; Type: DEV; Value: Value
IC41 = 74AVC8T245_QFN: 8 channel bidir translator buffer (1.4..3.6V)
IC42 = IFC_PCA9517: LEVEL-TRANSLATING I2C BUS REPEATER
L11 = L_CHOKE_ELLVGG: 2.2uH, 1.4A, 92mR Panasonic
R67 R68 R136 R137 R139-R141 R145 R146 R214 R271 = RES_0402: SMD Resistor; Supplier 1: Newark; Supplier Part Number 1: 59M6691

## Sheet Clock_WR.SchDoc
size A3; DocumentNumber: 24; SheetNumber: 24; SheetTotal: 30
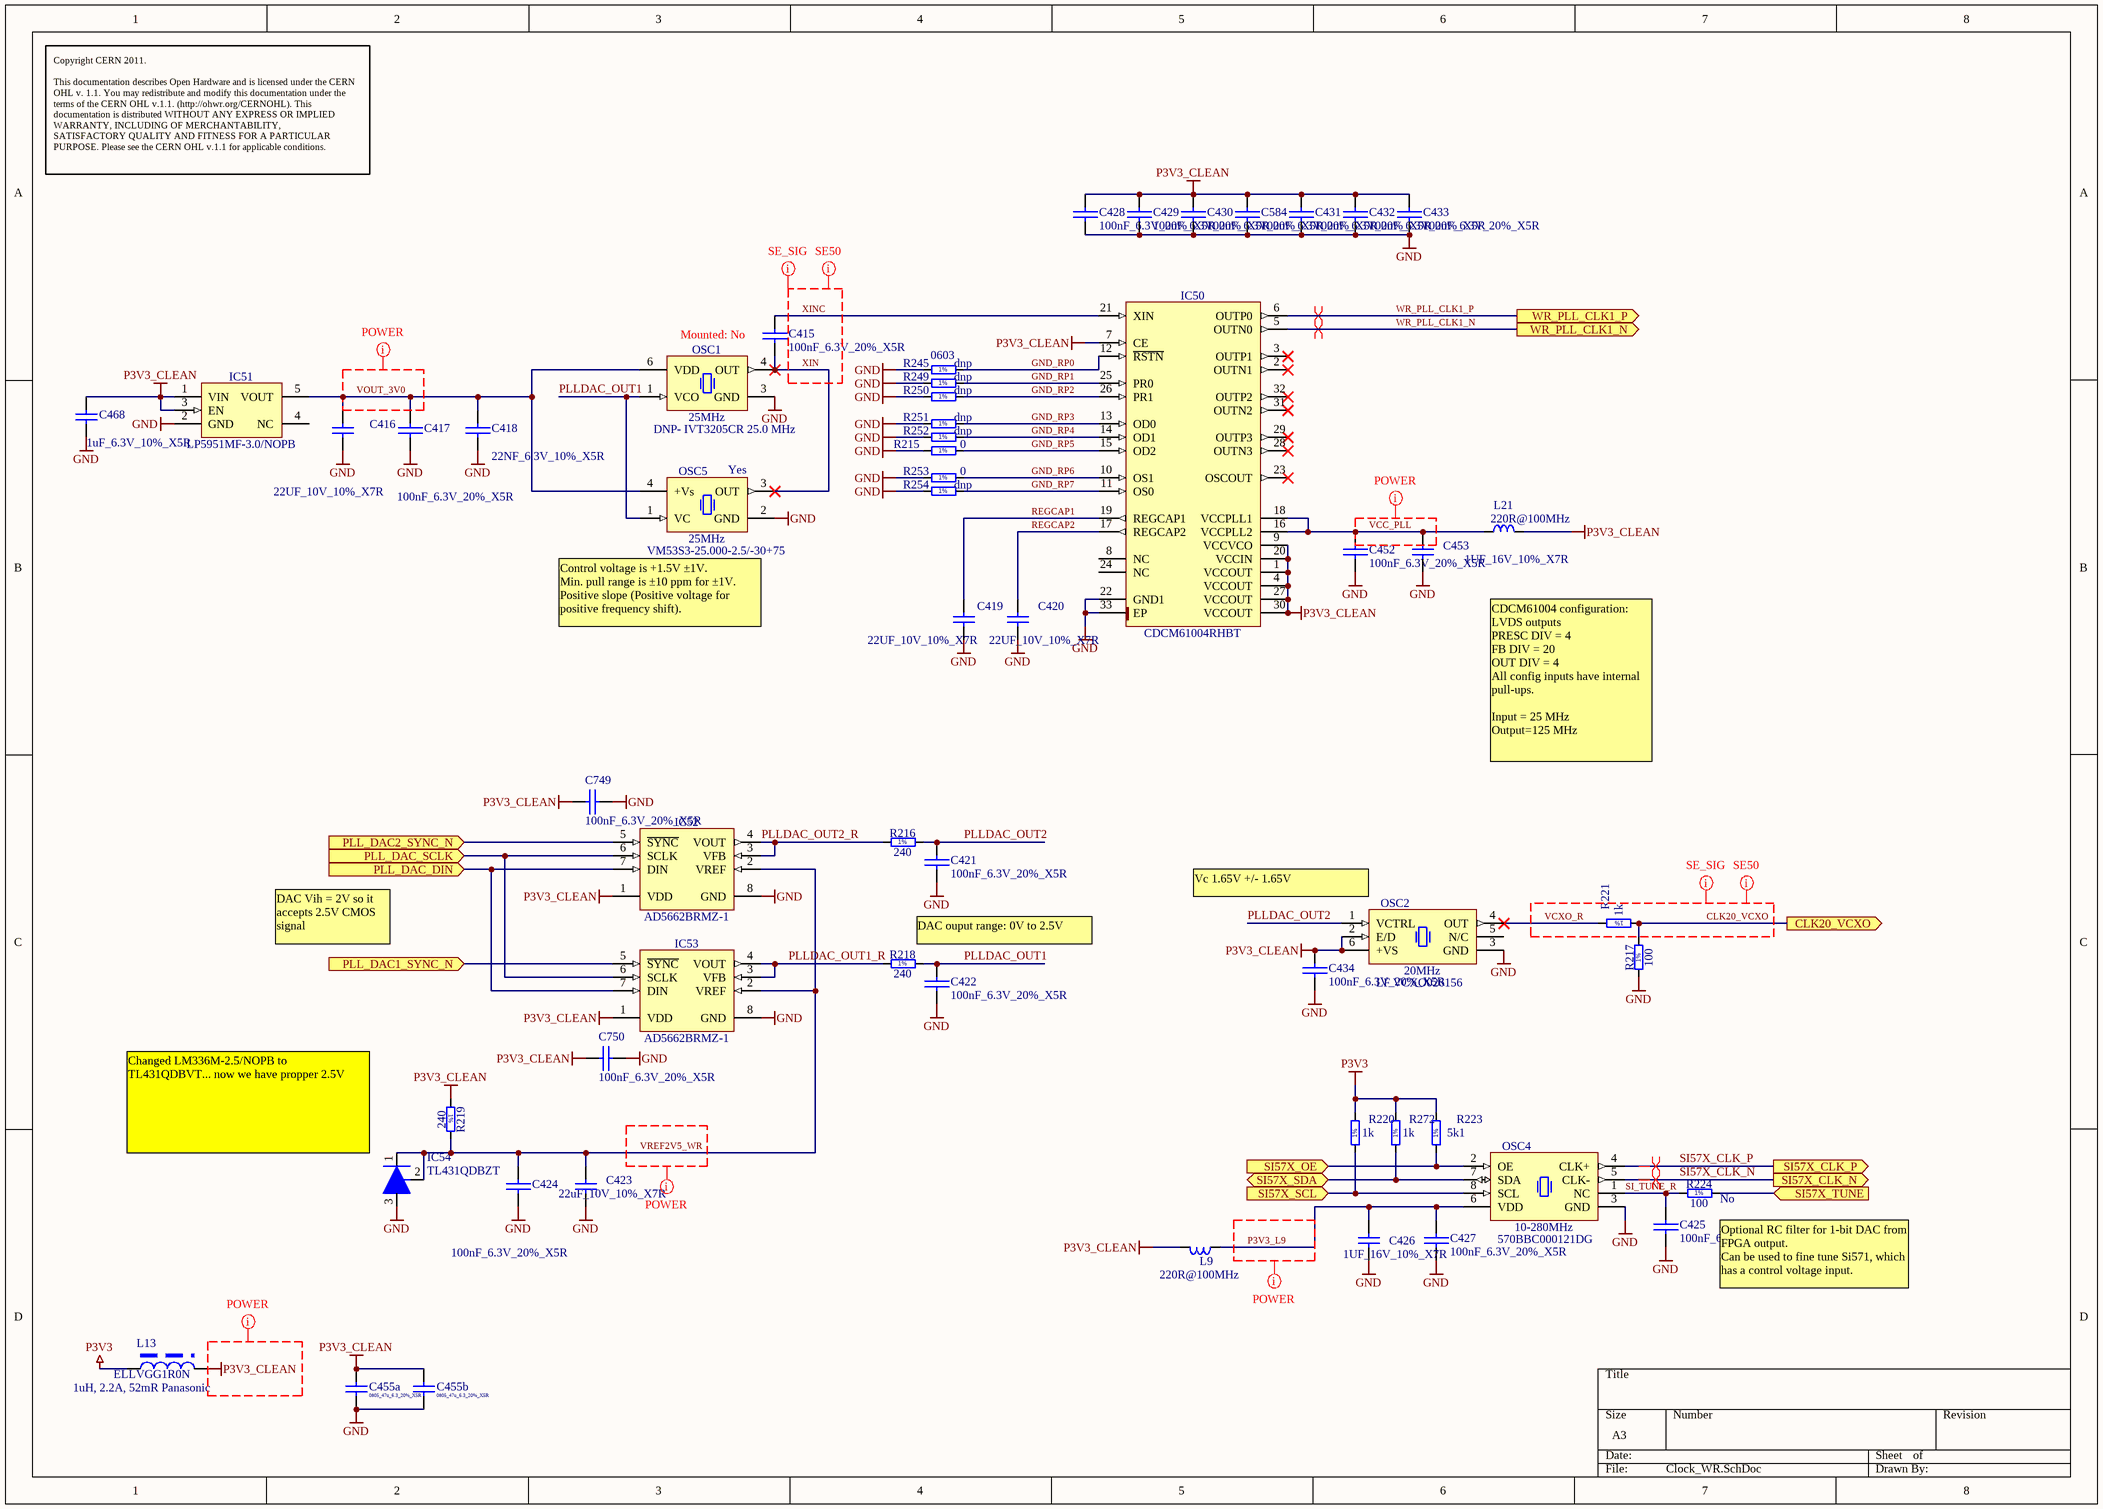
[diagram p18: Clock_WR.SchDoc]

### Parts
C415  100nF_6.3V_20%_X5R  [0201C]
C416  22UF_10V_10%_X7R  [CAPC1608X87N]
C417  100nF_6.3V_20%_X5R  [0201C]
C418  22NF_6.3V_10%_X5R  [0201C]
C419  22UF_10V_10%_X7R  [CAPC3216X180N]
C420  22UF_10V_10%_X7R  [CAPC3216X180N]
C421  100nF_6.3V_20%_X5R  [0201C]
C422  100nF_6.3V_20%_X5R  [0201C]
C423  22uF_10V_10%_X7R  [CAPC3216X180N]
C424  100nF_6.3V_20%_X5R  [0201C]
C425  100nF_6.3V_20%_X5R  [0201C]
C426  1UF_16V_10%_X7R  [CAPC1608X87N]
C427  100nF_6.3V_20%_X5R  [0201C]
C428  100nF_6.3V_20%_X5R  [0201C]
C429  100nF_6.3V_20%_X5R  [0201C]
C430  100nF_6.3V_20%_X5R  [0201C]
C431  100nF_6.3V_20%_X5R  [0201C]
C432  100nF_6.3V_20%_X5R  [0201C]
C433  100nF_6.3V_20%_X5R  [0201C]
C434  100nF_6.3V_20%_X5R  [0201C]
C452  100nF_6.3V_20%_X5R  [0201C]
C453  1UF_16V_10%_X7R  [CAPC1608X87N]
C455a  0805_47u_6.3_20%_X5R  [CAPC2012X140N]
C455b  0805_47u_6.3_20%_X5R  [CAPC2012X140N]
C468  1uF_6.3V_10%_X5R  [CAPC1608X87N]
C584  100nF_6.3V_20%_X5R  [0201C]
C749  100nF_6.3V_20%_X5R  [0201C]
C750  100nF_6.3V_20%_X5R  [0201C]
IC50  CDCM61004RHBT  [QFN50P500X500X100-33N-S355]
IC51  LP5951MF-3.0/NOPB  [SOT95P284X122-5N]
IC52  AD5662BRMZ-1  [SOP65P490X110-8N]
IC53  AD5662BRMZ-1  [SOP65P490X110-8N]
IC54  TL431QDBZT  [SOT-23]
L9  220R@100MHz  [INDC2012X105N]
L13  ELLVGG1R0N  [L_ELLVGG2R2N]
L21  220R@100MHz  [INDC2012X105N]
OSC1  25MHz  Manufacturer Part Number: DNP- IVT3205CR 25.0 MHz  Mounted: No  [OSC_RAKON_IVT3200C]
OSC2  20MHz  Manufacturer Part Number: LF VCXO026156  [OSC_IQD_CFPV-45]
OSC4  10-280MHz  Manufacturer Part Number: 570BBC000121DG  [OSC_SILICON-LAB_SI570]
OSC5  25MHz  Manufacturer Part Number: VM53S3-25.000-2.5/-30+75  Mounted: Yes  [OSCCC320X500X160-4N]
R215  0  [RESC1608X55N]
R216  240  [RESC1608X55N]
R217  100  [RESC1608X55N]
R218  240  [RESC1608X55N]
R219  240  [RESC1608X55N]
R220  1k  [RESC1608X55N]
R221  1k  [RESC1608X55N]
R223  5k1  [RESC1608X55N]
R224  100  Mounted: No  [RESC1608X55N]
R245  dnp  Case: 0603  [RESC1608X55N]
R249  dnp  [RESC1608X55N]
R250  dnp  [RESC1608X55N]
R251  dnp  [RESC1608X55N]
R252  dnp  [RESC1608X55N]
R253  0  [RESC1608X55N]
R254  dnp  [RESC1608X55N]
R272  1k  [RESC1608X55N]

### Ports
CLK20_VCXO (out), PLL_DAC1_SYNC_N (in), PLL_DAC2_SYNC_N (in), PLL_DAC_DIN (in), PLL_DAC_SCLK (in), SI57X_CLK_N (out), SI57X_CLK_P (out), SI57X_OE (in), SI57X_SCL (in), SI57X_SDA (bidir), SI57X_TUNE (in), WR_PLL_CLK1_N (out), WR_PLL_CLK1_P (out)

### Nets
GND: C416.1 C417.2 C418.1 C419.1 C420.1 C421.2 C422.2 C423.1 C424.2 C425.2 C426.1 C427.2 C428.1 C429.2 C430.2 C431.2 C432.2 C433.2 C434.2 C452.2 C453.1 C455a.1 C455b.1 C468.1 C584.2 C749.2 C750.2 IC50.22(GND1) IC50.33(EP) IC51.2(GND) IC52.8(GND) IC53.8(GND) IC54.3(A) OSC1.3(GND) OSC2.3(GND) OSC4.3(GND) OSC5.2(GND) R215.1 R217.1 R245.1 R249.1 R250.1 R251.1 R252.1 R253.1 R254.1
P3V3: L13.1 R220.2 R223.2 R272.2
P3V3_CLEAN: C428.2 C429.1 C430.1 C431.1 C432.1 C433.1 C434.1 C455a.2 C455b.2 C468.2 C584.1 C749.1 C750.1 IC50.1(VCCOUT) IC50.4(VCCOUT) IC50.7(CE) IC50.9(VCCVCO) IC50.20(VCCIN) IC50.27(VCCOUT) IC50.30(VCCOUT) IC51.1(VIN) IC51.3(EN) IC52.1(VDD) IC53.1(VDD) L9.2 L13.2 L21.2 OSC2.2(E/D) OSC2.6(+VS) R219.1
CLK20_VCXO: R217.2 R221.1 ; port CLK20_VCXO
GND_RP0: IC50.12(~{RSTN}) R245.2
GND_RP1: IC50.25(PR0) R249.2
GND_RP2: IC50.26(PR1) R250.2
GND_RP3: IC50.13(OD0) R251.2
GND_RP4: IC50.14(OD1) R252.2
GND_RP5: IC50.15(OD2) R215.2
GND_RP6: IC50.10(OS1) R253.2
GND_RP7: IC50.11(OS0) R254.2
P3V3_L9: C426.2 C427.1 L9.1 OSC4.6(VDD)
PLL_DAC1_SYNC_N: IC53.5(~{SYNC}) ; port PLL_DAC1_SYNC_N
PLL_DAC2_SYNC_N: IC52.5(~{SYNC}) ; port PLL_DAC2_SYNC_N
PLL_DAC_DIN: IC52.7(DIN) IC53.7(DIN) ; port PLL_DAC_DIN
PLL_DAC_SCLK: IC52.6(SCLK) IC53.6(SCLK) ; port PLL_DAC_SCLK
PLLDAC_OUT1: C422.1 OSC1.1(VCO) OSC5.1(VC) R218.2
PLLDAC_OUT1_R: IC53.3(VFB) IC53.4(VOUT) R218.1
PLLDAC_OUT2: C421.1 OSC2.1(VCTRL) R216.2
PLLDAC_OUT2_R: IC52.3(VFB) IC52.4(VOUT) R216.1
REGCAP1: C419.2 IC50.19(REGCAP1)
REGCAP2: C420.2 IC50.17(REGCAP2)
SI57X_CLK_N: OSC4.5(CLK-) ; port SI57X_CLK_N
SI57X_CLK_P: OSC4.4(CLK+) ; port SI57X_CLK_P
SI57X_OE: OSC4.2(OE) R223.1 ; port SI57X_OE
SI57X_SCL: OSC4.8(SCL) R220.1 ; port SI57X_SCL
SI57X_SDA: OSC4.7(SDA) R272.1 ; port SI57X_SDA
SI57X_TUNE: R224.2 ; port SI57X_TUNE
SI_TUNE_R: C425.1 OSC4.1(NC) R224.1
VCC_PLL: C452.1 C453.2 IC50.16(VCCPLL2) IC50.18(VCCPLL1) L21.1
VCXO_R: OSC2.4(OUT) R221.2
VOUT_3V0: C416.2 C417.1 C418.2 IC51.5(VOUT) OSC1.6(VDD) OSC5.4(+Vs)
VREF2V5_WR: C423.2 C424.1 IC52.2(VREF) IC53.2(VREF) IC54.1(I/O) IC54.2(REF) R219.2
WR_PLL_CLK1_N: IC50.5(OUTN0) ; port WR_PLL_CLK1_N
WR_PLL_CLK1_P: IC50.6(OUTP0) ; port WR_PLL_CLK1_P
XIN: C415.1 OSC1.4(OUT) OSC5.3(OUT)
XINC: C415.2 IC50.21(XIN)

Not connected (* = marked no-connect by the designer): IC50 2(OUTN1)* 3(OUTP1)* 8(NC) 23(OSCOUT)* 24(NC) 28(OUTN3)* 29(OUTP3)* 31(OUTN2)* 32(OUTP2)*; IC51 4(NC); OSC2 5(N/C)

### Layout directives
differential pair: SI57X_CLK_N, SI57X_CLK_P, WR_PLL_CLK1_N, WR_PLL_CLK1_P
net class DE_SIG: CLK20_VCXO, VCXO_R, XIN, XINC
net class SE50: CLK20_VCXO, VCXO_R, XIN, XINC
net class POWER: P3V3_CLEAN, P3V3_L9, VCC_PLL, VOUT_3V0, VREF2V5_WR

### Notes on the sheet
- Copyright CERN 2011.
  This documentation describes Open Hardware and is licensed under the CERN OHL v. 1.1. You may redistribute and modify this documentation under the terms of the CERN OHL v.1.1. (http://ohwr.org/CERNOHL). This documentation is distributed WITHOUT ANY EXPRESS OR IMPLIED WARRANTY, INCLUDING OF MERCHANTABILITY, SATISFACTORY QUALITY AND FITNESS FOR A PARTICULAR PURPOSE. Please see the CERN OHL v.1.1 for applicable conditions.
- (near OSC5) Control voltage is +1.5V ±1V.
  Min. pull range is ±10 ppm for ±1V.
  Positive slope (Positive voltage for positive frequency shift).
- CDCM61004 configuration:
  LVDS outputs
  PRESC DIV = 4
  FB DIV = 20
  OUT DIV = 4
  All config inputs have internal pull-ups.
  Input = 25 MHz
  Output=125 MHz
- (near OSC2) Vc 1.65V +/- 1.65V
- DAC Vih = 2V so it accepts 2.5V CMOS signal
- DAC ouput range: 0V to 2.5V
- (near IC54) Changed LM336M-2.5/NOPB to TL431QDBVT... now we have propper 2.5V
- (near R224) Optional RC filter for 1-bit DAC from FPGA output.
  Can be used to fine tune Si571, which has a control voltage input.
- (in symbol L_CHOKE_ELLVGG) 1uH, 2.2A, 52mR Panasonic
- (in symbol R0603_0R_JUMPER) 1%
- (in symbol R0603_1K_1%_0.1W_100PPM) 1%
- (in symbol R0603_5K1_1%_0.1W_100PPM) 1%
- (in symbol R0603_100R_1%_0.1W_100PPM) 1%
- (in symbol R0603_240R_1%_0.1W_100PPM) 1%

### Library data of the parts
C415 C417 C418 C421 C422 C424 C425 C427-C434 C452 C584 C749 C750 = CAP_SMD_0201: Capacitor SMD
C416 C426 C468 = CC0603_1UF_16V_10%_X7R: Non-polarised capacitor; Part Description: SMD Multilayer Chip Ceramic Capacitor; Manufacturer: GENERIC; Manufacturer1 Part Number: 223824613663; Value: 1uF; Voltage: 16V; TC: X7R; Tolerance: ±10%; Table: Capacitors SMD; Part Number: CC0603_1UF_16V_10%_X7R; Component Kind: Standard; Component Type: Standard; Pin Count: 2; Status: Preferred; Manufacturer Part Number: CC0603_1uF_16V_10%_X7R; Case: 0603; Mounted: Yes; Socket: No; SMD: Yes; Manufacturer1 Example: PHYCOMP; Manufacturer1 ComponentHeight: 0.87mm; HelpURL: \\cern.ch\dfs\Applications\Altium\Datasheets\CC0805_X5R_PHYCOMP_HC.pdf; Author: CERN DEM JLC; CreateDate: 03/12/2007; LatestRevisionDate: 03/12/2007
C419 C420 C423 = CC1206_22UF_10V_10%_X7R: Non-polarised capacitor; Part Description: SMD Multilayer Chip Ceramic Capacitor; Manufacturer: GENERIC; Manufacturer1 Part Number: GRM31CR71A226KE15L; Value: 22uF; Voltage: 10V; TC: X7R; Tolerance: ±10%; Table: Capacitors SMD; Part Number: CC1206_22UF_10V_10%_X7R; Component Kind: Standard; Component Type: Standard; Pin Count: 2; Status: Preferred; Manufacturer Part Number: CC1206_22UF_10V_10%_X7R; Case: 1206; Mounted: Yes; Socket: No; SMD: Yes; Manufacturer1 Example: MURATA; Manufacturer1 ComponentHeight: 1.8mm; HelpURL: \\cern.ch\dfs\Applications\Altium\Datasheets\CC1206_X7R_MURATA_GRM-HI-CAP.pdf; Author: CERN DEM JLC; CreateDate: 2010-06-08; LatestRevisionDate: 2010-06-08
C453 = CC0603_1UF_16V_10%_X7R: Non-polarised capacitor; Part Description: SMD Multilayer Chip Ceramic Capacitor; Manufacturer: GENERIC; Manufacturer1 Part Number: 223824613663; Manufacturer1 Datasheet: \\cern.ch\dfs\Applications\Altium\Datasheets\CC0805_X5R_PHYCOMP_HC.pdf; Value: 1uF; Voltage: 16V; TC: X7R; Tolerance: ±10%; Table: Capacitors SMD; Part Number: CC0603_1UF_16V_10%_X7R; Component Kind: Standard; Component Type: Standard; Designator: Capacitor - non polarized; Library Reference: Capacitor - non polarized; Pin Count: 2; Status: Preferred; Manufacturer Part Number: CC0603_1uF_16V_10%_X7R; Case: 0603; Mounted: Yes; Socket: No; SMD: Yes; Manufacturer1 Example: PHYCOMP; Manufacturer1 ComponentHeight: 0.87mm; HelpURL: \\cern.ch\dfs\Applications\Altium\Datasheets\CC0805_X5R_PHYCOMP_HC.pdf; Author: CERN DEM JLC; CreateDate: 03/12/2007; LatestRevisionDate: 03/12/2007
C455a C455b = Ceramic_0805: MiscInfo: Biggest Cern Footprint [max height]; Document Name: Clock_WR.SchDoc; Part Number: Ceramic_0805; FootprintSizeX (mm): 3.5; FootprintSizeY (mm): 2; FootprintRectangleArea (mm): 7; Thickness (Max) (mm): 1.4; FootprintAlias: 0805
IC50 = CDCM61004RHBT: Four Output, Integrated VCO, Low-Jitter Clock Generator; Manufacturer: TEXAS INSTRUMENTS; Table: Analog & Interface; Part Number: CDCM61004RHBT; Component Kind: Standard; Component Type: Standard; Device: CDCM61004RHBT; PackageDescription: QFN, (MO-220-VHHD-4) 0.50mm pitch,square; 8 pin X 8 pin, 5mm X 5mm X 1.00mm H body (w/thermal tab 3.5 X 3.5mm),  IPC Medium Density; Part Description: Four Output, Integrated VCO, Low-Jitter Clock Generator; Manufacturer Part Number: CDCM61004RHBT; Pin Count: 33; Case: QFN32; Mounted: Yes; Socket: No; SMD: Yes; ComponentHeight: 1mm; Author: CERN DEM JLC; HelpURL: \\cern.ch\dfs\Applications\Altium\Datasheets\CDCM61004RHBT.pdf; CreateDate: 2010-08-25; LatestRevisionDate: 2010-08-25
IC51 = LP5951MF-3.0/NOPB: 150mA Micropower Low-Dropout CMOS Voltage Regulator; Part Description: 3V,  150mA Micropower Low-Dropout CMOS Voltage Regulator; Manufacturer: NATIONAL SEMICONDUCTOR; Table: Regulators; Part Number: LP5951MF-3.0/NOPB; Component Kind: Standard; Component Type: Standard; Device: LP5951MF-3.0/NOPB; PackageDescription: SOT23 5, Pitch 0.95mm - Body 1.67x2.99mm, IPC Medium Density; Manufacturer Part Number: LP5951MF-3.0/NOPB; Pin Count: 5; Case: SOT23-5; Mounted: Yes; Socket: No; SMD: Yes; ComponentHeight: 1.19mm; HelpURL: \\cern.ch\dfs\Applications\Altium\Datasheets\LP5951MF-3.0-NOPB.pdf; Author: CERN DEM JLC; CreateDate: 24/01/2011; LatestRevisionDate: 24/01/2011
IC52 IC53 = AD5662BRMZ-1: 2.7V to 5.5V, 250uA, Rail-to-Rail Output 16-Bit nanoDAC; Manufacturer: ANALOG DEVICES; Table: Analog & Interface; Part Number: AD5662BRMZ-1; Component Kind: Standard; Component Type: Standard; Device: AD5662BRMZ-1; PackageDescription: SOP, 8-Leads, Body 3.0x3.0mm, Pitch 0.65mm, IPC Medium Density; Part Description: 2.7V to 5.5V, 250uA, Rail-to-Rail Output 16-Bit nanoDAC; Manufacturer Part Number: AD5662BRMZ-1; Pin Count: 8; Case: MSOP8; Mounted: Yes; Socket: No; SMD: Yes; ComponentHeight: 1.1mm; Author: CERN DEM JLC; HelpURL: \\cern.ch\dfs\Applications\Altium\Datasheets\AD5662BRMZ-1.pdf; CreateDate: 1/10/2011; LatestRevisionDate: 1/10/2011
IC54 = REF_TL431_SOT23: 2.5V ADJ Voltage reference
L9 L21 = IND0805_MURATA_BLM21PG221SN1D: Inductor; Part Description: SMD EMIFIL Suppression Chip Bead Ferrite; Manufacturer: MURATA; Power: 2A; Resistance: 0.05R; Tolerance: ±25%; Table: Inductors SMD; Part Number: IND0805_MURATA_BLM21PG221SN1D; Component Kind: Standard; Component Type: Standard; Pin Count: 2; Value: 220R@100MHz; Status: None; Manufacturer Part Number: BLM21PG221SN1D; Case: 0805; Mounted: Yes; Socket: No; SMD: Yes; ComponentHeight: 1.05mm; HelpURL: \\cern.ch\dfs\Applications\Altium\Datasheets\IND0402_MURATA_BLM21P.pdf; Author: CERN DEM JLC; CreateDate: 25/01/2010; LatestRevisionDate: 25/01/2010
L13 = L_CHOKE_ELLVGG: 2.2uH, 1.4A, 92mR Panasonic
OSC1 = OSC_25MHZ_RAKON_IVT3205CR: Oscillator 4 pins 1=VCO 3=GND 4=OUT 6=VDC; Part Description: 11pF 3.3V ±1ppm Surface Mount TCXO Voltage Controlled Oscillator (IT3200C Serie); Manufacturer: RAKON; Table: Crystals & Oscillators; Part Number: OSC_25MHZ_RAKON_IVT3205CR; Component Kind: Standard; Component Type: Standard; PackageDescription: Oscillator IVT3200C Serie, corner concave; 4 pin, 2.50mm L X 3.2mm W X 1.1mm H; Value: 25MHz; Pin Count: 4; Socket: No; SMD: Yes; ComponentHeight: 1.1mm; HelpURL: \\cern.ch\dfs\Applications\Altium\Datasheets\OSC_RAKON_IVT3200C.pdf; Author: CERN DEM JLC; CreateDate: 08/02/2010; LatestRevisionDate: 08/02/2010
OSC2 = OSC_20MHZ_IQD_LF VCXO026156: 3.3V ±100ppm 15pF HCMOS Tri-State Surface Mount Voltage Controlled Oscillator VCXO (CFPV-45 Serie); Manufacturer: IQD FREQUENCY PRODUCTS; Table: Crystals & Oscillators; Part Number: OSC_20MHZ_IQD_LF VCXO026156; Component Kind: Standard; Component Type: Standard; PackageDescription: SMD VCXO, side convave, 6 pins, 5.00x7.00mm (CFPV-45 Serie); Value: 20MHz; Part Description: 3.3V ±100ppm 15pF HCMOS Tri-State Surface Mount Voltage Controlled Oscillator VCXO (CFPV-45 Serie); Pin Count: 6; Mounted: Yes; Socket: No; SMD: Yes; ComponentHeight: 1.7mm; HelpURL: \\cern.ch\dfs\Applications\Altium\Datasheets\OSC_IQD_CFPV-45.pdf; Author: CERN DEM JLC; CreateDate: 1/24/2011; LatestRevisionDate: 1/24/2011
OSC4 = OSC_10-280MHZ_SILICON-LAB_Si570BBC000121DG: Any-Rate I2C Programmable XO Oscillator Si570 Serie; Part Description: 10-280MHz 3.3V ±20ppm LVDS Any-Rate I2C Programmable XO Oscillator Si570 Serie; Manufacturer: SILICON LABS; Table: Crystals & Oscillators; Part Number: OSC_10-280MHZ_SILICON-LAB_Si570BBC000121DG; Component Kind: Standard; Component Type: Standard; PackageDescription: Oscillator Si570 Serie, 8 pins, 5x7mm; Value: 10-280MHz; Pin Count: 8; Mounted: Yes; Socket: No; SMD: Yes; ComponentHeight: 1.85mm; HelpURL: \\cern.ch\dfs\Applications\Altium\Datasheets\OSC_SILICON-LAB_SI570.pdf; Author: CERN DEM JLC; CreateDate: 2/9/2010; LatestRevisionDate: 2/9/2010
OSC5 = OSC_25MHZ_MERCURY_VM53S3-25.000-2.5/-30+75: Oscillator 4 pins 1=VC 2=GND 3=OUT 4=+Vs; Part Description: 3V ±2.5ppmVoltage Controlled Temperature Compensated Crystal Oscillator VM53S3 Serie; Manufacturer: MERCURY ELECTRONICS; Table: Crystals & Oscillators; Part Number: OSC_25MHZ_MERCURY_VM53S3-25.000-2.5/-30+75; Component Kind: Standard; Component Type: Standard; PackageDescription: SMD Oscillator, Corner Convave, 4 pins, 5x3.2mm; Value: 25MHz; Pin Count: 4; Socket: No; SMD: Yes; ComponentHeight: 1.6mm; HelpURL: \\cern.ch\dfs\Applications\Altium\Datasheets\OSC_MERCURY_VM53S3.pdf; Author: CERN DEM JLC; CreateDate: 1/20/2010; LatestRevisionDate: 1/24/2011
R215 R253 = R0603_0R_JUMPER: Resistor - 1%; Part Description: 1A (0.05R Max DC Resistance) Zero Ohm Jumper; Manufacturer: GENERIC; Manufacturer1 Part Number: NRC06Z0; Table: Resistors SMD; Part Number: R0603_0R_JUMPER; Component Kind: Standard; Component Type: Standard; Pin Count: 2; Value: 0; Status: Preferred; Manufacturer Part Number: R0603_0R_JUMPER; Case: 0603; Socket: No; SMD: Yes; Manufacturer1 Example: NIC COMPONENT; Manufacturer1 ComponentHeight: 0.55mm; HelpURL: \\cern.ch\dfs\Applications\Altium\Datasheets\R0603_NIC_NRC.pdf; Author: CERN DEM JLC; CreateDate: 2007-12-03; LatestRevisionDate: 2008-03-13
R216 R218 R219 = R0603_240R_1%_0.1W_100PPM: Resistor - 1%; Part Description: General Purpose Thick Film Chip Resistor; Manufacturer: GENERIC; Manufacturer1 Part Number: NRC06F2400TRF; Power: 0.1W; TC: ±100ppm/°C; Table: Resistors SMD; Part Number: R0603_240R_1%_0.1W_100PPM; Component Kind: Standard; Component Type: Standard; Pin Count: 2; Value: 240; Status: Preferred; Tolerance: ±1%; Manufacturer Part Number: R0603_240R_1%_0.1W_100PPM; Case: 0603; Mounted: Yes; Socket: No; SMD: Yes; Manufacturer1 Example: NIC COMPONENT; Manufacturer1 ComponentHeight: 0.55mm; HelpURL: \\cern.ch\dfs\Applications\Altium\Datasheets\R0603_NIC_NRC.pdf; Author: CERN DEM JLC; CreateDate: 12/3/2007; LatestRevisionDate: 3/13/2008
R217 R224 = R0603_100R_1%_0.1W_100PPM: Resistor - 1%; Part Description: General Purpose Thick Film Chip Resistor; Manufacturer: GENERIC; Manufacturer1 Part Number: NRC06F4700TRF; Power: 0.1W; TC: ±100ppm/°C; Table: Resistors SMD; Part Number: R0603_100R_1%_0.1W_100PPM; Component Kind: Standard; Component Type: Standard; Pin Count: 2; Value: 100; Status: Preferred; Tolerance: ±1%; Manufacturer Part Number: R0603_100R_1%_0.1W_100PPM; Case: 0603; Socket: No; SMD: Yes; Manufacturer1 Example: NIC COMPONENT; Manufacturer1 ComponentHeight: 0.55mm; HelpURL: \\cern.ch\dfs\Applications\Altium\Datasheets\R0603_NIC_NRC.pdf; Author: CERN DEM JLC; CreateDate: 12/3/2007; LatestRevisionDate: 3/13/2008
  R217: Mounted: Yes
R220 R221 R272 = R0603_1K_1%_0.1W_100PPM: Resistor - 1%; Part Description: General Purpose Thick Film Chip Resistor; Manufacturer: GENERIC; Manufacturer1 Part Number: NRC06F1001TRF; Power: 0.1W; TC: ±100ppm/°C; Table: Resistors SMD; Part Number: R0603_1K_1%_0.1W_100PPM; Component Kind: Standard; Component Type: Standard; Pin Count: 2; Value: 1k; Status: Preferred; Tolerance: ±1%; Manufacturer Part Number: R0603_1K_1%_0.1W_100PPM; Case: 0603; Mounted: Yes; Socket: No; SMD: Yes; Manufacturer1 Example: NIC COMPONENT; Manufacturer1 ComponentHeight: 0.55mm; HelpURL: \\cern.ch\dfs\Applications\Altium\Datasheets\R0603_NIC_NRC.pdf; Author: CERN DEM JLC; CreateDate: 12/3/2007; LatestRevisionDate: 3/13/2008
R223 = R0603_5K1_1%_0.1W_100PPM: Resistor - 1%; Part Description: General Purpose Thick Film Chip Resistor; Manufacturer: GENERIC; Manufacturer1 Part Number: NRC06F5101TRF; Power: 0.1W; TC: ±100ppm/°C; Table: Resistors SMD; Part Number: R0603_5K1_1%_0.1W_100PPM; Component Kind: Standard; Component Type: Standard; Pin Count: 2; Value: 5k1; Status: Preferred; Tolerance: ±1%; Manufacturer Part Number: R0603_5K1_1%_0.1W_100PPM; Case: 0603; Mounted: Yes; Socket: No; SMD: Yes; Manufacturer1 Example: NIC COMPONENT; Manufacturer1 ComponentHeight: 0.55mm; HelpURL: \\cern.ch\dfs\Applications\Altium\Datasheets\R0603_NIC_NRC.pdf; Author: CERN DEM JLC; CreateDate: 03/12/2007; LatestRevisionDate: 13/03/2008
R245 R249-R252 R254 = R0603_0R_JUMPER: Resistor - 1%; Part Description: 1A (0.05R Max DC Resistance) Zero Ohm Jumper; Manufacturer: GENERIC; Manufacturer1 Part Number: NRC06Z0; Value: 0; Table: Resistors SMD; Part Number: R0603_0R_JUMPER; Component Kind: Standard; Component Type: Standard; Pin Count: 2; Status: Preferred; Manufacturer Part Number: R0603_0R_JUMPER; Socket: No; SMD: Yes; Manufacturer1 Example: NIC COMPONENT; Manufacturer1 ComponentHeight: 0.55mm; HelpURL: \\cern.ch\dfs\Applications\Altium\Datasheets\R0603_NIC_NRC.pdf; Author: CERN DEM JLC; CreateDate: 2007-12-03; LatestRevisionDate: 2008-03-13
  R249-R252 R254: Case: 0603

## Sheet FMC_Clocks.SchDoc
size A4; DocumentNumber: 27; SheetNumber: 27; SheetTotal: 30
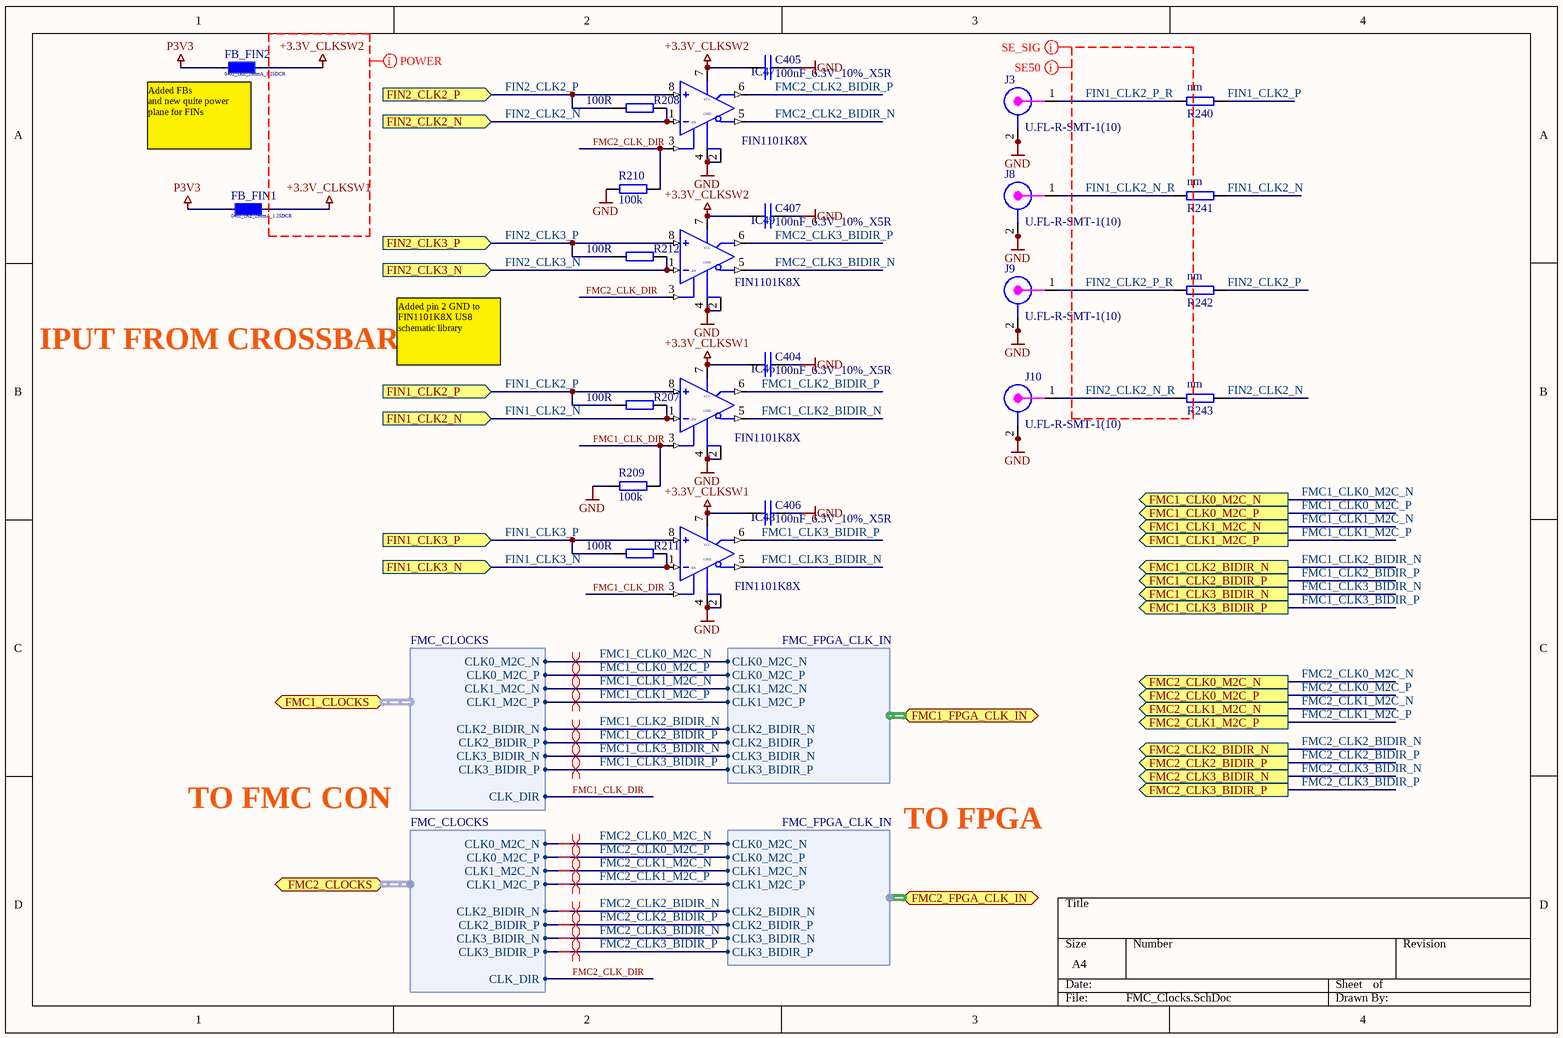
[diagram p19: FMC_Clocks.SchDoc]

### Parts
C404  100nF_6.3V_10%_X5R  [0201C]
C405  100nF_6.3V_10%_X5R  [0201C]
C406  100nF_6.3V_10%_X5R  [0201C]
C407  100nF_6.3V_10%_X5R  [0201C]
FB_FIN1  0402_1KZ_250mA_1.25DCR  [INDC1005X55N]
FB_FIN2  0402_1KZ_250mA_1.25DCR  [INDC1005X55N]
IC46  FIN1101K8X  [US8]
IC47  FIN1101K8X  [US8]
IC48  FIN1101K8X  [US8]
IC49  FIN1101K8X  [US8]
J3  U.FL-R-SMT-1(10)  [CON_UFL_HIROSE_RECEPTACLE]
J8  U.FL-R-SMT-1(10)  [CON_UFL_HIROSE_RECEPTACLE]
J9  U.FL-R-SMT-1(10)  [CON_UFL_HIROSE_RECEPTACLE]
J10  U.FL-R-SMT-1(10)  [CON_UFL_HIROSE_RECEPTACLE]
R207  100R  [0402R]
R208  100R  [0402R]
R209  100k  [0402R]
R210  100k  [0402R]
R211  100R  [0402R]
R212  100R  [0402R]
R240  nm  [0402R]
R241  nm  [0402R]
R242  nm  [0402R]
R243  nm  [0402R]

### Ports
FIN1_CLK2_N (in), FIN1_CLK2_P (in), FIN1_CLK3_N (in), FIN1_CLK3_P (in), FIN2_CLK2_N (in), FIN2_CLK2_P (in), FIN2_CLK3_N (in), FIN2_CLK3_P (in), FMC1_CLK0_M2C_N (out), FMC1_CLK0_M2C_P (out), FMC1_CLK1_M2C_N (out), FMC1_CLK1_M2C_P (out), FMC1_CLK2_BIDIR_N (out), FMC1_CLK2_BIDIR_P (out), FMC1_CLK3_BIDIR_N (out), FMC1_CLK3_BIDIR_P (out), FMC1_CLOCKS (harness FMC_CLOCKS), FMC1_FPGA_CLK_IN (harness FMC_FPGA_CLK_IN), FMC2_CLK0_M2C_N (out), FMC2_CLK0_M2C_P (out), FMC2_CLK1_M2C_N (out), FMC2_CLK1_M2C_P (out), FMC2_CLK2_BIDIR_N (out), FMC2_CLK2_BIDIR_P (out), FMC2_CLK3_BIDIR_N (out), FMC2_CLK3_BIDIR_P (out), FMC2_CLOCKS (harness FMC_CLOCKS), FMC2_FPGA_CLK_IN (harness FMC_FPGA_CLK_IN)

### Harnesses
FMC_CLOCKS: CLK0_M2C_N, CLK0_M2C_P, CLK1_M2C_N, CLK1_M2C_P, CLK_DIR, CLK2_BIDIR_N, CLK2_BIDIR_P, CLK3_BIDIR_N, CLK3_BIDIR_P
FMC_FPGA_CLK_IN: CLK0_M2C_N, CLK0_M2C_P, CLK1_M2C_N, CLK1_M2C_P, CLK2_BIDIR_N, CLK2_BIDIR_P, CLK3_BIDIR_N, CLK3_BIDIR_P

### Nets
+3.3V_CLKSW1: C404.1 C406.1 FB_FIN1.2(-) IC46.7(VCC) IC48.7(VCC)
+3.3V_CLKSW2: C405.1 C407.1 FB_FIN2.2(-) IC47.7(VCC) IC49.7(VCC)
GND: C404.2 C405.2 C406.2 C407.2 IC46.2(GND) IC46.4(GND) IC47.2(GND) IC47.4(GND) IC48.2(GND) IC48.4(GND) IC49.2(GND) IC49.4(GND) J3.2 J3.2a(GND) J8.2 J8.2a(GND) J9.2 J9.2a(GND) J10.2 J10.2a(GND) R209.1 R210.1
P3V3: FB_FIN1.1(+) FB_FIN2.1(+)
FIN1_CLK2_N: IC46.1(IN) R207.1 R241.1 ; port FIN1_CLK2_N
FIN1_CLK2_N_R: J8.1 R241.2
FIN1_CLK2_P: IC46.8(IN) R207.2 R240.1 ; port FIN1_CLK2_P
FIN1_CLK2_P_R: J3.1 R240.2
FIN1_CLK3_N: IC48.1(IN) R211.1 ; port FIN1_CLK3_N
FIN1_CLK3_P: IC48.8(IN) R211.2 ; port FIN1_CLK3_P
FIN2_CLK2_N: IC47.1(IN) R208.1 R243.1 ; port FIN2_CLK2_N
FIN2_CLK2_N_R: J10.1 R243.2
FIN2_CLK2_P: IC47.8(IN) R208.2 R242.1 ; port FIN2_CLK2_P
FIN2_CLK2_P_R: J9.1 R242.2
FIN2_CLK3_N: IC49.1(IN) R212.1 ; port FIN2_CLK3_N
FIN2_CLK3_P: IC49.8(IN) R212.2 ; port FIN2_CLK3_P
FMC1_CLK0_M2C_N: port FMC1_CLK0_M2C_N, port FMC1_CLOCKS.CLK0_M2C_N, port FMC1_FPGA_CLK_IN.CLK0_M2C_N  [project net CLKS1.CLK0_M2C_N]
FMC1_CLK0_M2C_P: port FMC1_CLK0_M2C_P, port FMC1_CLOCKS.CLK0_M2C_P, port FMC1_FPGA_CLK_IN.CLK0_M2C_P  [project net CLKS1.CLK0_M2C_P]
FMC1_CLK1_M2C_N: port FMC1_CLK1_M2C_N, port FMC1_CLOCKS.CLK1_M2C_N, port FMC1_FPGA_CLK_IN.CLK1_M2C_N  [project net CLKS1.CLK1_M2C_N]
FMC1_CLK1_M2C_P: port FMC1_CLK1_M2C_P, port FMC1_CLOCKS.CLK1_M2C_P, port FMC1_FPGA_CLK_IN.CLK1_M2C_P  [project net CLKS1.CLK1_M2C_P]
FMC1_CLK2_BIDIR_N: IC46.5(~{Q}) ; port FMC1_CLK2_BIDIR_N, port FMC1_CLOCKS.CLK2_BIDIR_N, port FMC1_FPGA_CLK_IN.CLK2_BIDIR_N  [project net CLKS1.CLK2_BIDIR_N]
FMC1_CLK2_BIDIR_P: IC46.6(Q) ; port FMC1_CLK2_BIDIR_P, port FMC1_CLOCKS.CLK2_BIDIR_P, port FMC1_FPGA_CLK_IN.CLK2_BIDIR_P  [project net CLKS1.CLK2_BIDIR_P]
FMC1_CLK3_BIDIR_N: IC48.5(~{Q}) ; port FMC1_CLK3_BIDIR_N, port FMC1_CLOCKS.CLK3_BIDIR_N, port FMC1_FPGA_CLK_IN.CLK3_BIDIR_N  [project net CLKS1.CLK3_BIDIR_N]
FMC1_CLK3_BIDIR_P: IC48.6(Q) ; port FMC1_CLK3_BIDIR_P, port FMC1_CLOCKS.CLK3_BIDIR_P, port FMC1_FPGA_CLK_IN.CLK3_BIDIR_P  [project net CLKS1.CLK3_BIDIR_P]
FMC1_CLK_DIR: IC46.3(EN) IC48.3(EN) R209.2 ; port FMC1_CLOCKS.CLK_DIR  [project net CLKS1.CLK_DIR]
FMC2_CLK0_M2C_N: port FMC2_CLK0_M2C_N, port FMC2_CLOCKS.CLK0_M2C_N, port FMC2_FPGA_CLK_IN.CLK0_M2C_N  [project net CLKS2.CLK0_M2C_N]
FMC2_CLK0_M2C_P: port FMC2_CLK0_M2C_P, port FMC2_CLOCKS.CLK0_M2C_P, port FMC2_FPGA_CLK_IN.CLK0_M2C_P  [project net CLKS2.CLK0_M2C_P]
FMC2_CLK1_M2C_N: port FMC2_CLK1_M2C_N, port FMC2_CLOCKS.CLK1_M2C_N, port FMC2_FPGA_CLK_IN.CLK1_M2C_N  [project net CLKS2.CLK1_M2C_N]
FMC2_CLK1_M2C_P: port FMC2_CLK1_M2C_P, port FMC2_CLOCKS.CLK1_M2C_P, port FMC2_FPGA_CLK_IN.CLK1_M2C_P  [project net CLKS2.CLK1_M2C_P]
FMC2_CLK2_BIDIR_N: IC47.5(~{Q}) ; port FMC2_CLK2_BIDIR_N, port FMC2_CLOCKS.CLK2_BIDIR_N, port FMC2_FPGA_CLK_IN.CLK2_BIDIR_N  [project net CLKS2.CLK2_BIDIR_N]
FMC2_CLK2_BIDIR_P: IC47.6(Q) ; port FMC2_CLK2_BIDIR_P, port FMC2_CLOCKS.CLK2_BIDIR_P, port FMC2_FPGA_CLK_IN.CLK2_BIDIR_P  [project net CLKS2.CLK2_BIDIR_P]
FMC2_CLK3_BIDIR_N: IC49.5(~{Q}) ; port FMC2_CLK3_BIDIR_N, port FMC2_CLOCKS.CLK3_BIDIR_N, port FMC2_FPGA_CLK_IN.CLK3_BIDIR_N  [project net CLKS2.CLK3_BIDIR_N]
FMC2_CLK3_BIDIR_P: IC49.6(Q) ; port FMC2_CLK3_BIDIR_P, port FMC2_CLOCKS.CLK3_BIDIR_P, port FMC2_FPGA_CLK_IN.CLK3_BIDIR_P  [project net CLKS2.CLK3_BIDIR_P]
FMC2_CLK_DIR: IC47.3(EN) IC49.3(EN) R210.2 ; port FMC2_CLOCKS.CLK_DIR  [project net CLKS2.CLK_DIR]

### Layout directives
differential pair: CLKS1.CLK0_M2C_N, CLKS1.CLK0_M2C_P, CLKS1.CLK1_M2C_N, CLKS1.CLK1_M2C_P, CLKS1.CLK2_BIDIR_N, CLKS1.CLK2_BIDIR_P, CLKS1.CLK3_BIDIR_N, CLKS1.CLK3_BIDIR_P, CLKS2.CLK0_M2C_N, CLKS2.CLK0_M2C_P, CLKS2.CLK1_M2C_N, CLKS2.CLK1_M2C_P, CLKS2.CLK2_BIDIR_N, CLKS2.CLK2_BIDIR_P, CLKS2.CLK3_BIDIR_N, CLKS2.CLK3_BIDIR_P
net class SE_SIG: FIN1_CLK2_N_R, FIN1_CLK2_P_R, FIN2_CLK2_N_R, FIN2_CLK2_P_R
net class SE50: FIN1_CLK2_N_R, FIN1_CLK2_P_R, FIN2_CLK2_N_R, FIN2_CLK2_P_R
net class POWER: +3.3V_CLKSW1, +3.3V_CLKSW2

### Notes on the sheet
- (near FB_FIN2) Added FBs
  and new quite power plane for FINs
- IPUT FROM CROSSBAR
- Added pin 2 GND to FIN1101K8X US8 schematic library
- TO FMC CON
- TO FPGA

### Library data of the parts
C404-C407 = CAP_SMD_0201: Capacitor SMD
FB_FIN1 FB_FIN2 = BLM15HD102SN1D: FILTER CHIP 1000 OHM 250MA 0402; Manufacturer: Murata Electronics North America; Impedance @ Frequency: 1K Ohm @ 100MHz; DC Resistance (DCR): 1.25 Ohm Max; Filter Type: Differential Mode - Single; Document Name: FMC_Clocks.SchDoc; Part Number: BLM15HD102SN1D; ParamsList: 0402_1KZ_250mA_1.25DCR; Supplier 1: Digi-Key; Supplier Part Number 1: 490-4003-1-ND; Manufacturer Part Number: BLM15HD102SN1D; RoHS: RoHS Compliant; Category: Filters; Stock 1: 324163; Pricing 1: 1=0.42, 10=0.332, 50=0.2186, 100=0.1734, 250=0.1282, 500=0.09952, 1000=0.07842, 5000=0.05881 (USD); Current Rating: 250mA; Package / Case: 0402 (1005 Metric); Mounting Type: Surface Mount; Packaging: Cut Tape (CT); Height (Max): 0.022" (0.55mm); Size / Dimension: 0.039" L x 0.020" W (1.00mm x 0.50mm); ComponentLink1URL: http://search.murata.co.jp/Ceramy/image/img/PDF/ENG/L0110S0101BLM15H.pdf; ComponentLink1Description: http://search.murata.co.jp/Ceramy/image/img/PDF/ENG/L0110S0101BLM15H.pdf; FootprintSizeX (mm): 1.82; FootprintSizeY (mm): 0.92; FootprintRectangleArea (mm): 1.67; Thickness (Max) (mm): 0.55; FootprintAlias: 0402
IC46-IC49 = IFC_FIN1101K8X: LVDS TO LVDS repeater3.3V
J3 J8-J10 = CON_UFL_SMD: UFL; Supplier 1: Newark; Supplier Part Number 1: 50P8856
R207-R212 R240-R243 = RES_0402: SMD Resistor; Supplier 1: Newark; Supplier Part Number 1: 59M6691